# Altium project slave-14-mc33775.PrjPcb (part 1 of 2)
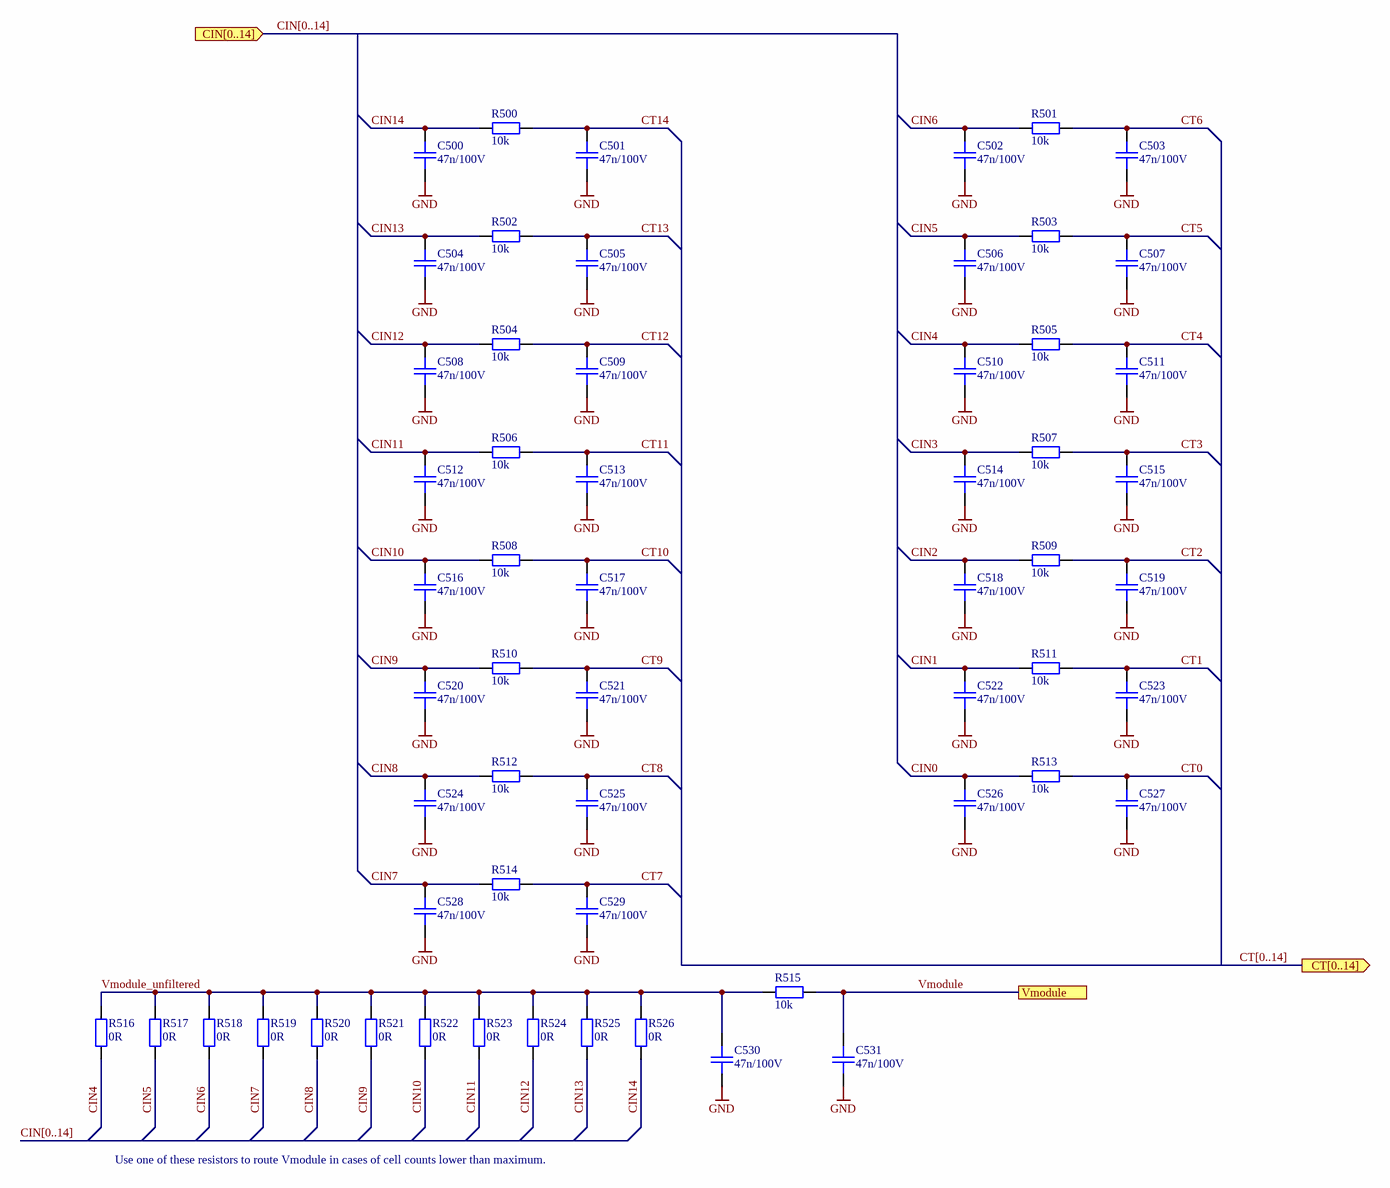
[diagram p0: input_filter.SchDoc]
GlobalAuthor: foxBMS Team; GlobalDate: 2024-11-07; GlobalLicense: Creative Commons Attribution 4.0; GlobalProject: BMS-Slave 14-Cell MC33775; GlobalStatus: A; GlobalVersion: 1.0.2
8 sheets, 209 parts. Net scope: hierarchical (ports join the sheet entries above them; power ports are global).
Board file: slave-14-mc33775.PcbDoc
Sheets:
  input_filter.SchDoc
  analog_in.SchDoc
  connectors_org.SchDoc
  sensors.SchDoc
  digital_io.SchDoc
  ldo.SchDoc
  connectors_new.SchDoc
  connectors.SchDoc

## Sheet input_filter.SchDoc
size A3; DocumentNumber: 3; SheetNumber: 3; SheetTotal: 11; SheetDescription: Cell Input Filter

### Parts
C500  47n/100V  [CAPC1608X08N]
C501  47n/100V  [CAPC1608X08N]
C502  47n/100V  [CAPC1608X08N]
C503  47n/100V  [CAPC1608X08N]
C504  47n/100V  [CAPC1608X08N]
C505  47n/100V  [CAPC1608X08N]
C506  47n/100V  [CAPC1608X08N]
C507  47n/100V  [CAPC1608X08N]
C508  47n/100V  [CAPC1608X08N]
C509  47n/100V  [CAPC1608X08N]
C510  47n/100V  [CAPC1608X08N]
C511  47n/100V  [CAPC1608X08N]
C512  47n/100V  [CAPC1608X08N]
C513  47n/100V  [CAPC1608X08N]
C514  47n/100V  [CAPC1608X08N]
C515  47n/100V  [CAPC1608X08N]
C516  47n/100V  [CAPC1608X08N]
C517  47n/100V  [CAPC1608X08N]
C518  47n/100V  [CAPC1608X08N]
C519  47n/100V  [CAPC1608X08N]
C520  47n/100V  [CAPC1608X08N]
C521  47n/100V  [CAPC1608X08N]
C522  47n/100V  [CAPC1608X08N]
C523  47n/100V  [CAPC1608X08N]
C524  47n/100V  [CAPC1608X08N]
C525  47n/100V  [CAPC1608X08N]
C526  47n/100V  [CAPC1608X08N]
C527  47n/100V  [CAPC1608X08N]
C528  47n/100V  [CAPC1608X08N]
C529  47n/100V  [CAPC1608X08N]
C530  47n/100V  [CAPC1608X08N]
C531  47n/100V  [CAPC1608X08N]
R500  10k  [RESC1608X05N]
R501  10k  [RESC1608X05N]
R502  10k  [RESC1608X05N]
R503  10k  [RESC1608X05N]
R504  10k  [RESC1608X05N]
R505  10k  [RESC1608X05N]
R506  10k  [RESC1608X05N]
R507  10k  [RESC1608X05N]
R508  10k  [RESC1608X05N]
R509  10k  [RESC1608X05N]
R510  10k  [RESC1608X05N]
R511  10k  [RESC1608X05N]
R512  10k  [RESC1608X05N]
R513  10k  [RESC1608X05N]
R514  10k  [RESC1608X05N]
R515  10k  [RESC1608X05N]
R516  0R  [RESC1608X05N]
R517  0R  [RESC1608X05N]
R518  0R  [RESC1608X05N]
R519  0R  [RESC1608X05N]
R520  0R  [RESC1608X05N]
R521  0R  [RESC1608X05N]
R522  0R  [RESC1608X05N]
R523  0R  [RESC1608X05N]
R524  0R  [RESC1608X05N]
R525  0R  [RESC1608X05N]
R526  0R  [RESC1608X05N]

### Ports
CIN[0..14] (in), CT[0..14] (out), Vmodule

### Nets
GND: C500.1 C501.1 C502.1 C503.1 C504.1 C505.1 C506.1 C507.1 C508.1 C509.1 C510.1 C511.1 C512.1 C513.1 C514.1 C515.1 C516.1 C517.1 C518.1 C519.1 C520.1 C521.1 C522.1 C523.1 C524.1 C525.1 C526.1 C527.1 C528.1 C529.1 C530.1 C531.1
CIN0: C526.2 R513.2
CIN1: C522.2 R511.2
CIN2: C518.2 R509.2
CIN3: C514.2 R507.2
CIN4: C510.2 R505.2 R516.1
CIN5: C506.2 R503.2 R517.1
CIN6: C502.2 R501.2 R518.1
CIN7: C528.2 R514.2 R519.1
CIN8: C524.2 R512.2 R520.1
CIN9: C520.2 R510.2 R521.1
CIN10: C516.2 R508.2 R522.1
CIN11: C512.2 R506.2 R523.1
CIN12: C508.2 R504.2 R524.1
CIN13: C504.2 R502.2 R525.1
CIN14: C500.2 R500.2 R526.1
CT0: C527.2 R513.1
CT1: C523.2 R511.1
CT2: C519.2 R509.1
CT3: C515.2 R507.1
CT4: C511.2 R505.1
CT5: C507.2 R503.1
CT6: C503.2 R501.1
CT7: C529.2 R514.1
CT8: C525.2 R512.1
CT9: C521.2 R510.1
CT10: C517.2 R508.1
CT11: C513.2 R506.1
CT12: C509.2 R504.1
CT13: C505.2 R502.1
CT14: C501.2 R500.1
Vmodule: C531.2 R515.1 ; port Vmodule
Vmodule_unfiltered: C530.2 R515.2 R516.2 R517.2 R518.2 R519.2 R520.2 R521.2 R522.2 R523.2 R524.2 R525.2 R526.2

### Buses and harness runs
bus CIN[0..14]
bus CIN[0..14] = port CIN[0..14]
bus CT[0..14] = port CT[0..14]

### Notes on the sheet
- Use one of these resistors to route Vmodule in cases of cell counts lower than maximum.
- Fraunhofer IISB
- Schottkystr. 10
- developed by:
- 91058 Erlangen
- Germany
- Author
- Project
- License
- Description
- File
- Version
- Release Date
- Sheet
- foxbms.org <https://foxbms.org>
- www.iisb.fraunhofer.de <https://www.iisb.fraunhofer.de/>
- foxBMS Team
- /

### Library data of the parts
C500-C531 = gen_C_ceramic_47n_100V_X7R_0603: MLCC; Capacitance: 47n; Rated Voltage: 100V; Dielectric: X7R; Case EIA: 0603; Case Metric: 1608; Automotive Qualified: True; PnP Package: 0603C; Part Number: gen_C_ceramic_47n_100V_X7R_0603; Supplier 1: Farnell; Supplier Part Number 1: 2478249; Supplier 2: Farnell; Supplier Part Number 2: 2708699; Supplier 3: Farnell; Supplier Part Number 3: 2905110
R500-R515 = gen_R_10k_0603: SMD Resistor 10k 0603; Tolerance: 1%; Power: 0.1W; Case EIA: 0603; Case Metric: 1608; Maximum Working Voltage: 75V; PnP Package: 0603R; Automotive Qualified: True; Part Number: gen_R_10k_0603; Operating Temperature: -55°C - +155°C; Resistance: 10k; Series: E24, E96; PnP Value: 10k; Supplier 1: Farnell; Supplier Part Number 1: 2073349
R516-R526 = gen_R_0R_0603: SMD Resistor 0R 0603; Power: 0.1W; Case EIA: 0603; Case Metric: 1608; Maximum Working Voltage: 75V; PnP Package: 0603R; Automotive Qualified: True; PnP equipped: x; Part Number: gen_R_0R_0603; Operating Temperature: -55°C - +155°C; Resistance: 0R; Series: Jumper; PnP Value: 0R; Supplier 1: Farnell; Supplier Part Number 1: 2616580

## Sheet analog_in.SchDoc
size A3; DocumentNumber: 5; SheetNumber: 5; SheetTotal: 11; AUTHOR: Fraunhofer IISB foxBMS Team; SheetDescription: I2C analog multiplexer for temperature inputs
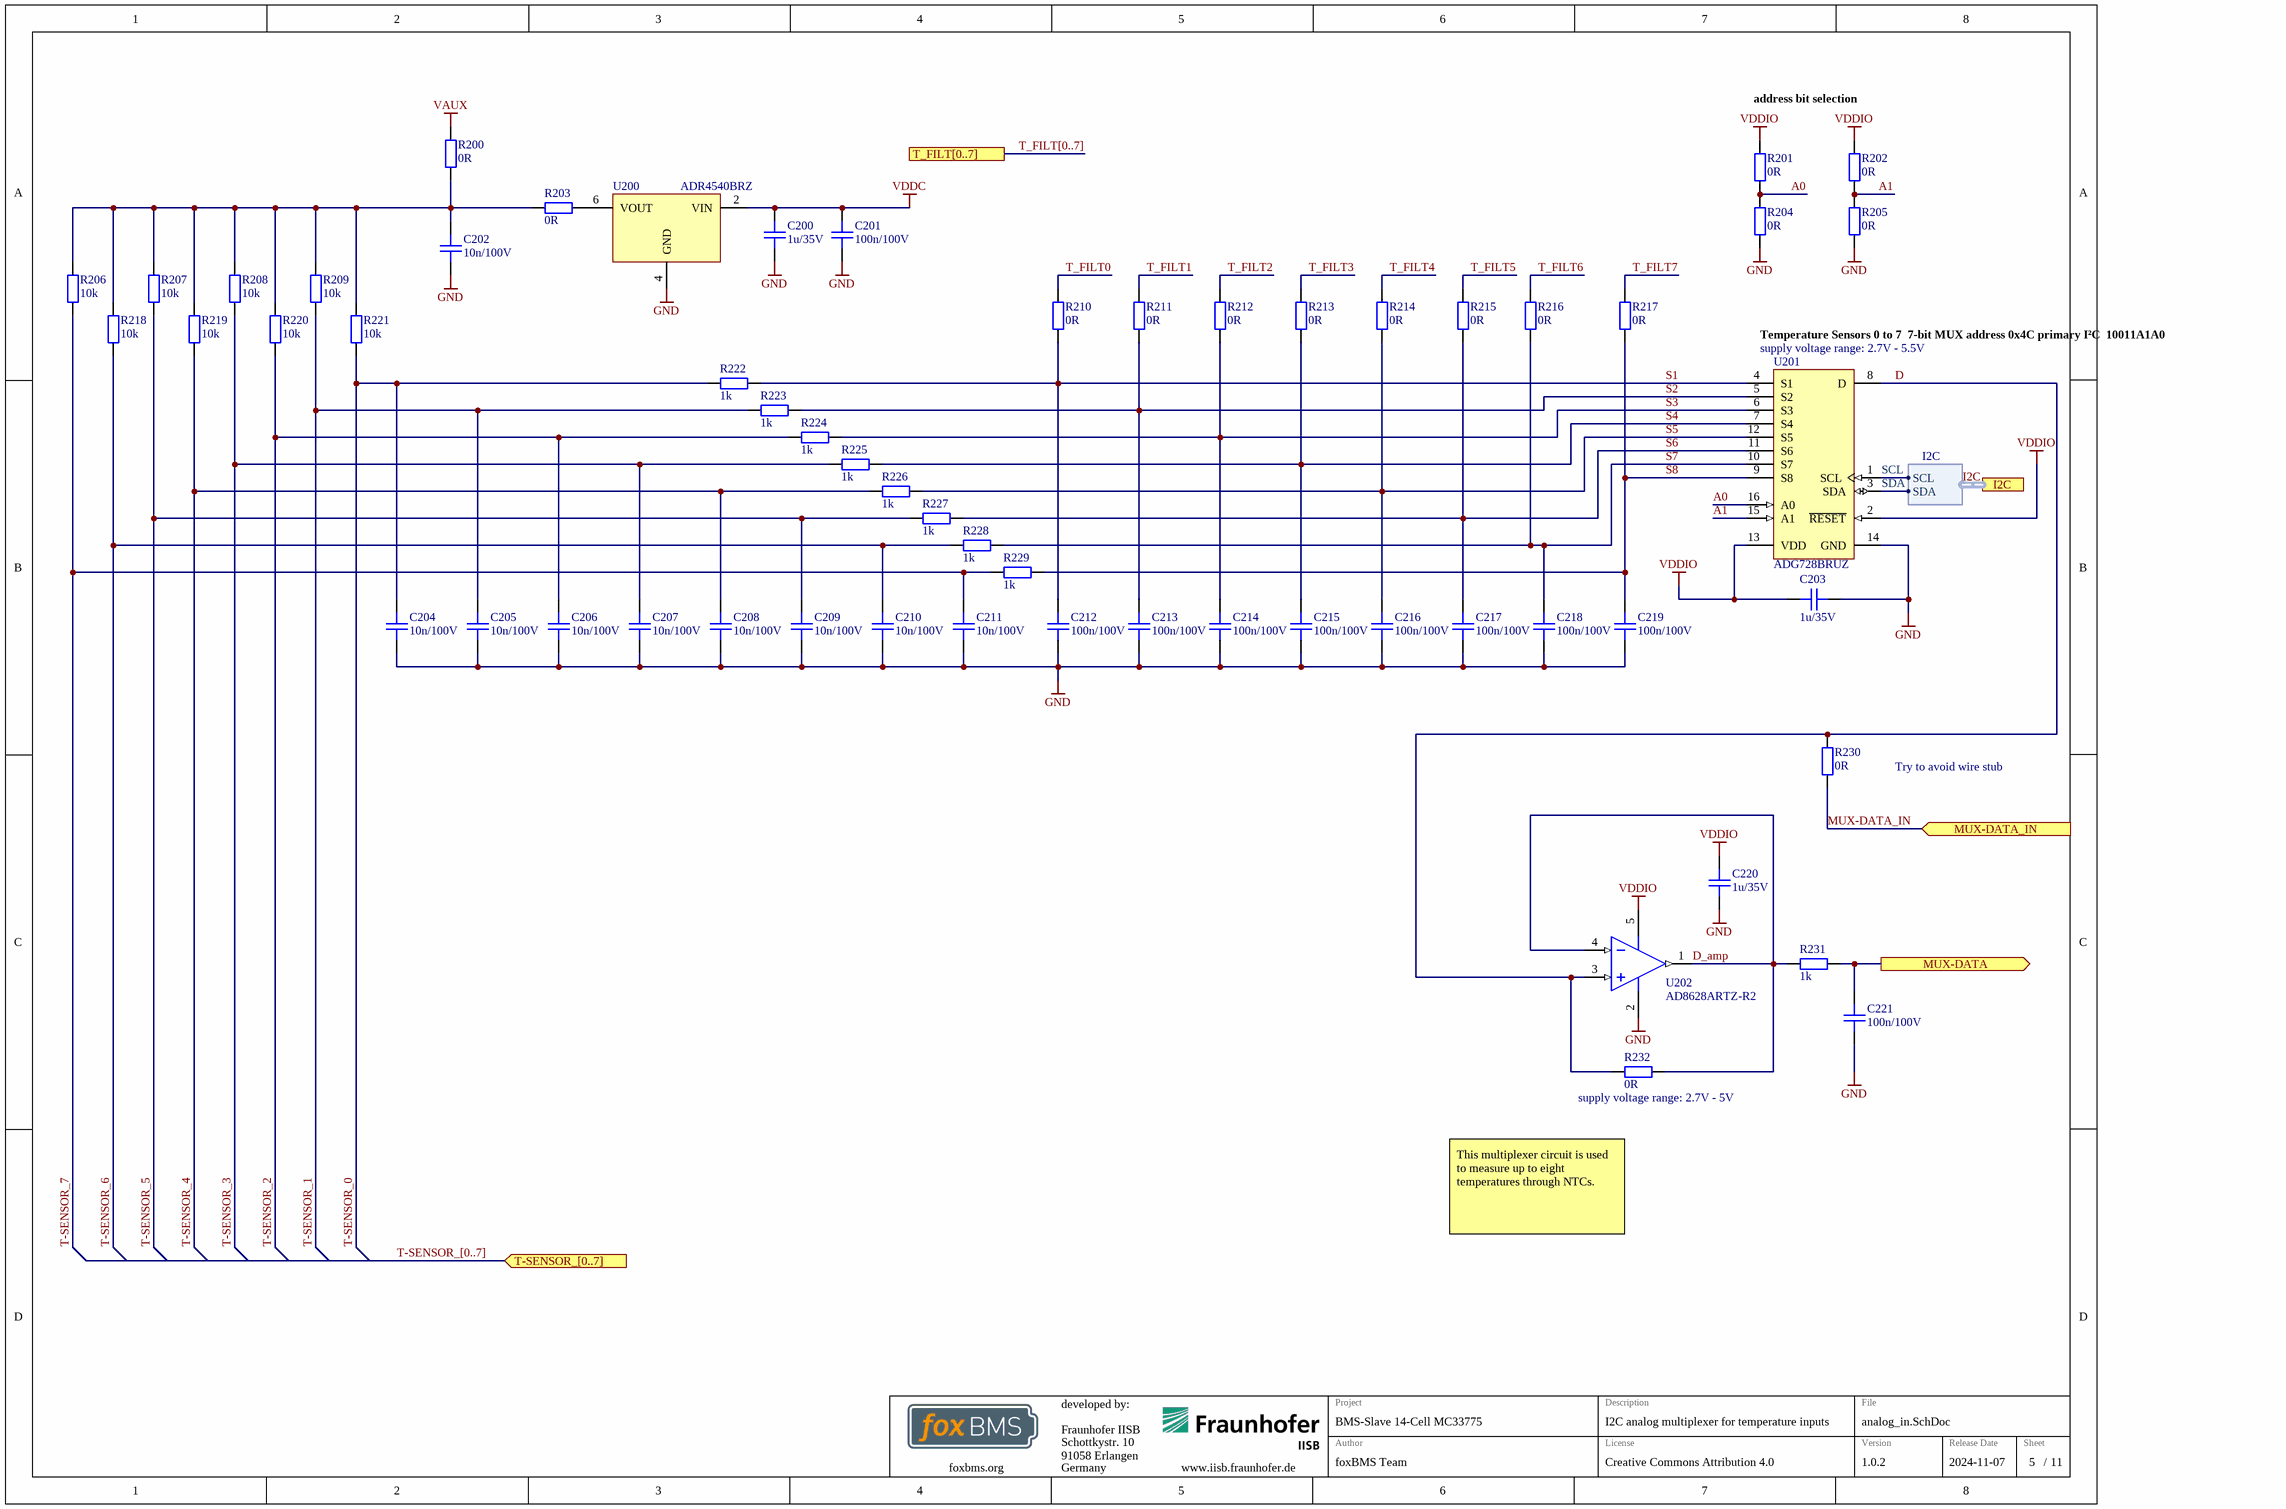
[diagram p1: analog_in.SchDoc]

### Parts
C200  1u/35V  [CAPC1608X08N]
C201  100n/100V  [CAPC1608X08N]
C202  10n/100V  [CAPC1608X08N]
C203  1u/35V  [CAPC1608X08N]
C204  10n/100V  [CAPC1608X08N]
C205  10n/100V  [CAPC1608X08N]
C206  10n/100V  [CAPC1608X08N]
C207  10n/100V  [CAPC1608X08N]
C208  10n/100V  [CAPC1608X08N]
C209  10n/100V  [CAPC1608X08N]
C210  10n/100V  [CAPC1608X08N]
C211  10n/100V  [CAPC1608X08N]
C212  100n/100V  [CAPC1608X08N]
C213  100n/100V  [CAPC1608X08N]
C214  100n/100V  [CAPC1608X08N]
C215  100n/100V  [CAPC1608X08N]
C216  100n/100V  [CAPC1608X08N]
C217  100n/100V  [CAPC1608X08N]
C218  100n/100V  [CAPC1608X08N]
C219  100n/100V  [CAPC1608X08N]
C220  1u/35V  [CAPC1608X08N]
C221  100n/100V  [CAPC1608X08N]
R200  0R  [RESC1608X05N]
R201  0R  [RESC1608X05N]
R202  0R  [RESC1608X05N]
R203  0R  [RESC1608X05N]
R204  0R  [RESC1608X05N]
R205  0R  [RESC1608X05N]
R206  10k  [RESC1608X05N]
R207  10k  [RESC1608X05N]
R208  10k  [RESC1608X05N]
R209  10k  [RESC1608X05N]
R210  0R  [RESC1608X05N]
R211  0R  [RESC1608X05N]
R212  0R  [RESC1608X05N]
R213  0R  [RESC1608X05N]
R214  0R  [RESC1608X05N]
R215  0R  [RESC1608X05N]
R216  0R  [RESC1608X05N]
R217  0R  [RESC1608X05N]
R218  10k  [RESC1608X05N]
R219  10k  [RESC1608X05N]
R220  10k  [RESC1608X05N]
R221  10k  [RESC1608X05N]
R222  1k  [RESC1608X05N]
R223  1k  [RESC1608X05N]
R224  1k  [RESC1608X05N]
R225  1k  [RESC1608X05N]
R226  1k  [RESC1608X05N]
R227  1k  [RESC1608X05N]
R228  1k  [RESC1608X05N]
R229  1k  [RESC1608X05N]
R230  0R  [RESC1608X05N]
R231  1k  [RESC1608X05N]
R232  0R  [RESC1608X05N]
U200  ADR4540BRZ  [SOIC127P600X175-8N]
U201  ADG728BRUZ  [ADI-RU-16_M]
U202  AD8628ARTZ-R2  [ADI-RJ-5_M]

### Ports
I2C (harness I2C), MUX-DATA (out), MUX-DATA_IN (in), T-SENSOR_[0..7] (in), T_FILT[0..7]

### Harnesses
I2C: SCL, SDA

### Nets
GND: C200.1 C201.1 C202.1 C203.1 C204.1 C205.1 C206.1 C207.1 C208.1 C209.1 C210.1 C211.1 C212.1 C213.1 C214.1 C215.1 C216.1 C217.1 C218.1 C219.1 C220.1 C221.1 R204.1 R205.1 U200.4(GND) U201.14(GND) U202.2(-V)
VAUX: R200.2
VDDC: C200.2 C201.2 U200.2(VIN)
VDDIO: C203.2 C220.2 R201.2 R202.2 U201.2(~{RESET}) U201.13(VDD) U202.5(+V)
A0: R201.1 R204.2 U201.16(A0)
A1: R202.1 R205.2 U201.15(A1)
D: R230.1 R232.1 U201.8(D) U202.3(+IN)
D_amp: R231.1 R232.2 U202.1(OUT) U202.4(-IN)
MUX-DATA_IN: R230.2 ; port MUX-DATA_IN
S1: C212.2 R210.1 R222.1 U201.4(S1)
S2: C213.2 R211.1 R223.1 U201.5(S2)
S3: C214.2 R212.1 R224.1 U201.6(S3)
S4: C215.2 R213.1 R225.1 U201.7(S4)
S5: C216.2 R214.1 R226.1 U201.12(S5)
S6: C217.2 R215.1 R227.1 U201.11(S6)
S7: C218.2 R216.1 R228.1 U201.10(S7)
S8: C219.2 R217.1 R229.1 U201.9(S8)
SCL: U201.1(SCL) ; port I2C.SCL  [project net I2C.SCL]
SDA: U201.3(SDA) ; port I2C.SDA  [project net I2C.SDA]
T-SENSOR_0: C204.2 R221.1 R222.2
T-SENSOR_1: C205.2 R209.1 R223.2
T-SENSOR_2: C206.2 R220.1 R224.2
T-SENSOR_3: C207.2 R208.1 R225.2
T-SENSOR_4: C208.2 R219.1 R226.2
T-SENSOR_5: C209.2 R207.1 R227.2
T-SENSOR_6: C210.2 R218.1 R228.2
T-SENSOR_7: C211.2 R206.1 R229.2
T_FILT0: R210.2
T_FILT1: R211.2
T_FILT2: R212.2
T_FILT3: R213.2
T_FILT4: R214.2
T_FILT5: R215.2
T_FILT6: R216.2
T_FILT7: R217.2
NetC202_2: C202.2 R200.1 R203.1 R206.2 R207.2 R208.2 R209.2 R218.2 R219.2 R220.2 R221.2
NetC221_2: C221.2 R231.2 ; port MUX-DATA
NetR203_2: R203.2 U200.6(VOUT)

### Buses and harness runs
bus T-SENSOR_[0..7] = port T-SENSOR_[0..7]
bus T_FILT[0..7] = port T_FILT[0..7]
harness I2C = port I2C

### Notes on the sheet
- address bit selection
- (near U201) Temperature Sensors 0 to 7
  7-bit MUX address 0x4C primary I²C
  10011A1A0
- (near U201) supply voltage range: 2.7V - 5.5V
- Try to avoid wire stub
- (near R232) supply voltage range: 2.7V - 5V
- This multiplexer circuit is used to measure up to eight temperatures through NTCs.
- Fraunhofer IISB
- Schottkystr. 10
- developed by:
- 91058 Erlangen
- Germany
- Author
- Project
- License
- Description
- File
- Version
- Release Date
- Sheet
- foxbms.org <https://foxbms.org>
- www.iisb.fraunhofer.de <https://www.iisb.fraunhofer.de/>
- foxBMS Team
- /

### Library data of the parts
C200 = gen_C_ceramic_1u_35V_X7R_0603: MLCC; Capacitance: 1u; Rated Voltage: 35V; Dielectric: X7R; Case EIA: 0603; Case Metric: 1608; PnP Package: 0603C; PnP Value: 1uF/35V/X7R; PnP equipped: x; Automotive Qualified: True; AEC-Q Norm: AEC-Q200; Part Number: gen_C_ceramic_1u_35V_X7R_0603; Operating Temperature: -55°C - +125°C; Supplier 1: Farnell; Supplier Part Number 1: 2906941; ECCN: EAR99
C201 C212-C219 C221 = gen_C_ceramic_100n_100V_X7R_0603: MLCC; Capacitance: 100n; Rated Voltage: 100V; Dielectric: X7R; Case EIA: 0603; Case Metric: 1608; Automotive Qualified: True; PnP Package: 0603C; Part Number: gen_C_ceramic_100n_100V_X7R_0603; Supplier 1: Digikey; Supplier Part Number 1: 490-13420-1-ND; Supplier 2: Mouser; Supplier Part Number 2: 81-GCJ188R72A104KA1D
C202 = gen_C_ceramic_10n_100V_X7R_0603: MLCC; Capacitance: 10n; Rated Voltage: 100V; Dielectric: X7R; Case EIA: 0603; Case Metric: 1608; Automotive Qualified: True; PnP Package: 0603C; PnP Value: 10nF/100V/X7R; AEC-Q Norm: AEC-Q200; Part Number: gen_C_ceramic_10n_100V_X7R_0603; Supplier 1: Farnell; Supplier Part Number 1: 1301715; Supplier 2: Farnell; Supplier Part Number 2: 2821192; Supplier 3: Farnell; Supplier Part Number 3: 2210878; ECCN: EAR99
C203 C220 = gen_C_ceramic_1u_35V_X7R_0603: MLCC; Capacitance: 1u; Rated Voltage: 35V; Dielectric: X7R; Case EIA: 0603; Case Metric: 1608; Automotive Qualified: True; PnP Package: 0603C; PnP Value: 1uF/35V/X7R; PnP equipped: x; AEC-Q Norm: AEC-Q200; Part Number: gen_C_ceramic_1u_35V_X7R_0603; Supplier 1: Farnell; Supplier Part Number 1: 2906941; Operating Temperature: -55°C - +125°C; ECCN: EAR99
C204-C211 = gen_C_ceramic_10n_100V_X7R_0603: MLCC; Capacitance: 10n; Rated Voltage: 100V; Dielectric: X7R; Case EIA: 0603; Case Metric: 1608; PnP Package: 0603C; PnP Value: 10nF/100V/X7R; Automotive Qualified: True; AEC-Q Norm: AEC-Q200; Part Number: gen_C_ceramic_10n_100V_X7R_0603; Supplier 1: Farnell; Supplier Part Number 1: 1301715; Supplier 2: Farnell; Supplier Part Number 2: 2821192; Supplier 3: Farnell; Supplier Part Number 3: 2210878; ECCN: EAR99
R200-R205 R210-R217 R230 R232 = gen_R_0R_0603: as R516 on sheet input_filter; Part Number: gen_R_0R_0603; Operating Temperature: -55°C - +155°C; Resistance: 0R; Series: Jumper; PnP Value: 0R; Supplier 1: Farnell; Supplier Part Number 1: 2616580
R206-R209 R218-R221 = gen_R_10k_0603: as R500 on sheet input_filter; Part Number: gen_R_10k_0603; Operating Temperature: -55°C - +155°C; Resistance: 10k; Series: E24, E96; PnP Value: 10k; Supplier 1: Farnell; Supplier Part Number 1: 2073349
R222-R229 R231 = gen_R_1k_0603: SMD Resistor 1k 0603; Tolerance: 1%; Power: 0.1W; Case EIA: 0603; Case Metric: 1608; Maximum Working Voltage: 75V; PnP Package: 0603R; Automotive Qualified: True; PnP equipped: x; Part Number: gen_R_1k_0603; Operating Temperature: -55°C - +155°C; Resistance: 1k; Series: E24, E96; PnP Value: 1k; Supplier 1: Farnell; Supplier Part Number 1: 1652848
U200 = ADR4540BRZ: Ultralow Noise, High Accuracy 4.096V Reference; Manufacturer: Analog Devices; PnP Package: SO-8; Automotive Qualified: True; AEC-Q Norm: AEC-Q100; AEC-Q Grade: unknown; Part Number: ADR4540BRZ; Part Name: ADR4540BRZ; Operating Temperature: −40°C - +125°C; ComponentLink1Description: Datasheet; ComponentLink1URL: http://www.analog.com/media/en/technical-documentation/data-sheets/ADR4520_4525_4530_4533_4540_4550.pdf; Supplier 1: Farnell; Supplier Part Number 1: 2112692; Supplier 2: Mouser; Supplier Part Number 2: 584-ADR4540BRZ; Supplier 3: Digikey; Supplier Part Number 3: ADR4540BRZ-ND; ECCN: EAR99
U201 = CMP-0798-00197-1: CMOS, Low Voltage, 2-Wire Serially Controlled, Matrix Switch, -40 to 85 degC, 16-pin SOP (RU-16), Tube; Manufacturer: Analog Devices; Ron (ohms): 2.5; Supply V Guar Performance: Single_(+3V), Single_(+5V); Max Analog Signal Range: 0 to Vdd; Bandwidth (Hz): 65M; ComponentLink3Description: Package Specification; Packing: Tube; PartNumber: ADG728BRUZ; ComponentLink1URL: http://www.analog.com/en/index.html; Mounting Technology: Surface Mount; DatasheetVersion: Rev. C; ComponentLink1Description: Manufacturer URL; ComponentLink3URL: http:/www.analog.com/static/imported-files/packages/36244347913743854010197452789RU16.pdf; ComponentLink2URL: http://www.analog.com/static/imported-files/data_sheets/ADG728_729.pdf; PackageVersion: Nov-02; PackageDescription: 16-Pin Thin Shrink Small Outline Package, Body 5 x 4.4 mm, Pitch 0.65 mm; Code_JEDEC: MO-153AB; PackageReference: RU-16; ComponentLink2Description: Datasheet
U202 = CMP-0384-01512-2: Single Channel RRIO Operational Amplifier, 2.5 MHz BW, 1 V/us SR, Industrial, 5-pin SOT23 (RJ-5), Reel; Manufacturer: Analog Devices; Generic Part Number: AD8628; Iq/Amp: 1.1mA; Automotive Qualified: Yes; V Span Max: 6V; Input Bias Current: 30pA; Slew Rate: 1V/us; Amplifiers Per Package: 1; Input Offset Voltage: 1uV; Small Signal Bandwidth: 2.5MHz; V Span Min: 2.7V; ComponentLink1Description: Manufacturer URL; DatasheetVersion: Rev. I; ComponentLink4Description: Reference Circuit; Code_JEDEC: MO-178-AA; PackageDescription: 5-Pin Small Outline Transistor Package, Body 2.9 x 1.6 mm, Pitch 0.95 mm; ComponentLink3URL: http://www.analog.com/static/imported-files/packages/PKG_PDF/SOT-23(RJ)/RJ_5.pdf; PackageReference: RJ-5; ComponentLink1URL: http://www.analog.com/en/index.html; PackageVersion: 121608-A; RevisionNote: Reference Circuit URL fixed; Mounting Technology: Surface Mount; ComponentLink2Description: Datasheet; ComponentLink3Description: Package Specification; ComponentLink4URL: http://www.analog.com/en/all-operational-amplifiers-op-amps/operational-amplifiers-op-amps/ad8628/products/product.html#product-recommendations; ComponentLink2URL: http://www.analog.com/static/imported-files/data_sheets/AD8628_8629_8630.pdf; PartNumber: AD8628ARTZ-R2

## Sheet connectors_org.SchDoc: foxBMS BMS-Slave 12-Cell
size A3; DocumentNumber: 6; SheetNumber: 6; SheetTotal: 11; AUTHOR: Fraunhofer IISB foxBMS Team; SheetDescription: Connectors
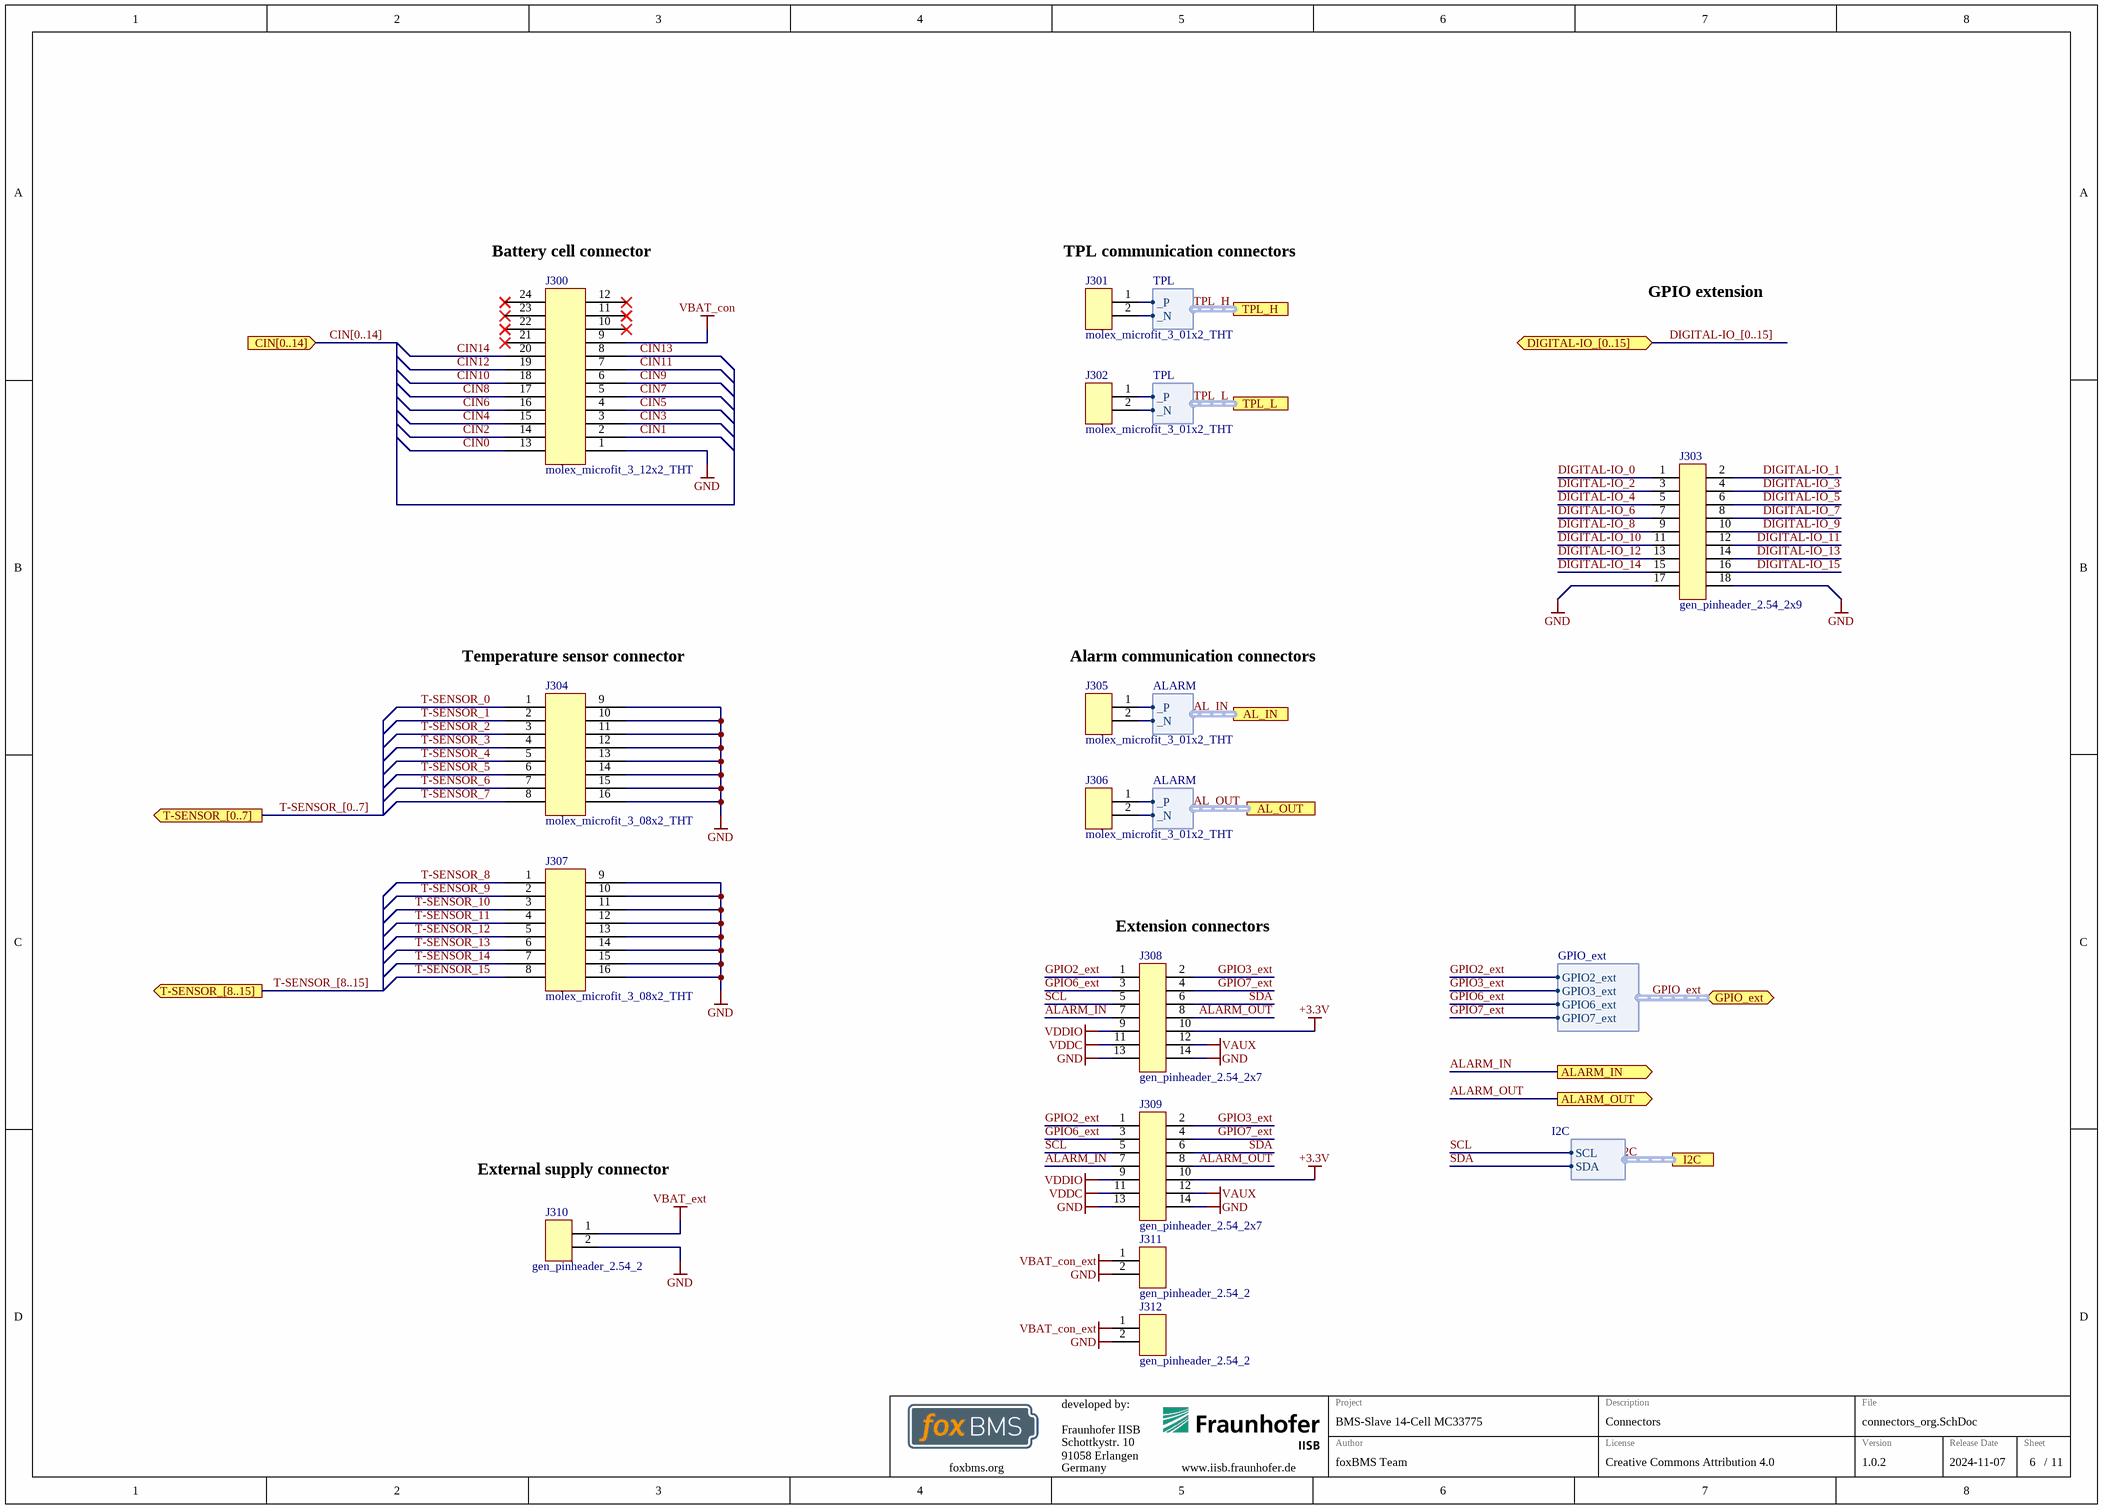
[diagram p2: connectors_org.SchDoc]

### Parts
(Parts that share a designator on the sheet are numbered #1, #2 ... from top to bottom, then left to right.)
J300#1  molex_microfit_3_12x2_THT  [MOLEX_MICROFIT_12x2_THT]
J301#1  molex_microfit_3_01x2_THT  [MOLEX_MICROFIT_01x2_THT]
J302#1  molex_microfit_3_01x2_THT  [MOLEX_MICROFIT_01x2_THT]
J303#1  gen_pinheader_2.54_2x9  [Pinheader_2.54_2x9]
J304#1  molex_microfit_3_08x2_THT  [MOLEX_MICROFIT_08x2_THT]
J305#1  molex_microfit_3_01x2_THT  [MOLEX_MICROFIT_01x2_THT]
J306#1  molex_microfit_3_01x2_THT  [MOLEX_MICROFIT_01x2_THT]
J307#1  molex_microfit_3_08x2_THT  [MOLEX_MICROFIT_08x2_THT]
J308#1  gen_pinheader_2.54_2x7  [Pinheader_2.54_2x7]
J309#1  gen_pinheader_2.54_2x7  [Pinheader_2.54_2x7]
J310  gen_pinheader_2.54_2  [Pinheader_2.54_2]
J311#1  gen_pinheader_2.54_2  [Pinheader_2.54_2]
J312#1  gen_pinheader_2.54_2  [Pinheader_2.54_2]

### Ports
AL_IN (harness ALARM), AL_OUT (harness ALARM), ALARM_IN (out), ALARM_OUT (out), CIN[0..14] (in), DIGITAL-IO_[0..15] (bidir), GPIO_ext (bidir, harness GPIO_ext), I2C (harness I2C), T-SENSOR_[0..7] (out), T-SENSOR_[8..15] (out), TPL_H (harness TPL), TPL_L (harness TPL)

### Harnesses
TPL: _P, _N
ALARM: _P, _N
GPIO_ext: GPIO3_ext, GPIO2_ext, GPIO6_ext, GPIO7_ext
I2C: SCL, SDA

### Nets
+3.3V: J308#1.10 J309#1.10
GND: J300#1.1 J303#1.17 J303#1.18 J304#1.9 J304#1.10 J304#1.11 J304#1.12 J304#1.13 J304#1.14 J304#1.15 J304#1.16 J307#1.9 J307#1.10 J307#1.11 J307#1.12 J307#1.13 J307#1.14 J307#1.15 J307#1.16 J308#1.13 J308#1.14 J309#1.13 J309#1.14 J310.2 J311#1.2 J312#1.2
VAUX: J308#1.12 J309#1.12
VBAT_con: J300#1.9
VBAT_con_ext: J311#1.1 J312#1.1
VBAT_ext: J310.1
VDDC: J308#1.11 J309#1.11
VDDIO: J308#1.9 J309#1.9
AL_IN._N: J305#1.2 ; port AL_IN._N
AL_IN._P: J305#1.1 ; port AL_IN._P
AL_OUT._N: J306#1.2 ; port AL_OUT._N
AL_OUT._P: J306#1.1 ; port AL_OUT._P
ALARM_IN: J308#1.7 J309#1.7 ; port ALARM_IN
ALARM_OUT: J308#1.8 J309#1.8 ; port ALARM_OUT
CIN0: J300#1.13
CIN1: J300#1.2
CIN2: J300#1.14
CIN3: J300#1.3
CIN4: J300#1.15
CIN5: J300#1.4
CIN6: J300#1.16
CIN7: J300#1.5
CIN8: J300#1.17
CIN9: J300#1.6
CIN10: J300#1.18
CIN11: J300#1.7
CIN12: J300#1.19
CIN13: J300#1.8
CIN14: J300#1.20
DIGITAL-IO_0: J303#1.1
DIGITAL-IO_1: J303#1.2
DIGITAL-IO_2: J303#1.3
DIGITAL-IO_3: J303#1.4
DIGITAL-IO_4: J303#1.5
DIGITAL-IO_5: J303#1.6
DIGITAL-IO_6: J303#1.7
DIGITAL-IO_7: J303#1.8
DIGITAL-IO_8: J303#1.9
DIGITAL-IO_9: J303#1.10
DIGITAL-IO_10: J303#1.11
DIGITAL-IO_11: J303#1.12
DIGITAL-IO_12: J303#1.13
DIGITAL-IO_13: J303#1.14
DIGITAL-IO_14: J303#1.15
DIGITAL-IO_15: J303#1.16
GPIO2_ext: J308#1.1 J309#1.1 ; port GPIO_ext.GPIO2_ext
GPIO3_ext: J308#1.2 J309#1.2 ; port GPIO_ext.GPIO3_ext
GPIO6_ext: J308#1.3 J309#1.3 ; port GPIO_ext.GPIO6_ext
GPIO7_ext: J308#1.4 J309#1.4 ; port GPIO_ext.GPIO7_ext
SCL: J308#1.5 J309#1.5 ; port I2C.SCL  [project net I2C.SCL]
SDA: J308#1.6 J309#1.6 ; port I2C.SDA  [project net I2C.SDA]
T-SENSOR_0: J304#1.1
T-SENSOR_1: J304#1.2
T-SENSOR_2: J304#1.3
T-SENSOR_3: J304#1.4
T-SENSOR_4: J304#1.5
T-SENSOR_5: J304#1.6
T-SENSOR_6: J304#1.7
T-SENSOR_7: J304#1.8
T-SENSOR_8: J307#1.1
T-SENSOR_9: J307#1.2
T-SENSOR_10: J307#1.3
T-SENSOR_11: J307#1.4
T-SENSOR_12: J307#1.5
T-SENSOR_13: J307#1.6
T-SENSOR_14: J307#1.7
T-SENSOR_15: J307#1.8
TPL_H._N: J301#1.2 ; port TPL_H._N
TPL_H._P: J301#1.1 ; port TPL_H._P
TPL_L._N: J302#1.2 ; port TPL_L._N
TPL_L._P: J302#1.1 ; port TPL_L._P

Not connected (* = marked no-connect by the designer): J300#1 10* 11* 12* 21* 22* 23* 24*

### Buses and harness runs
bus CIN[0..14] = port CIN[0..14]
bus DIGITAL-IO_[0..15] = port DIGITAL-IO_[0..15]
bus T-SENSOR_[0..7] = port T-SENSOR_[0..7]
bus T-SENSOR_[8..15] = port T-SENSOR_[8..15]
harness AL_IN = port AL_IN
harness AL_OUT = port AL_OUT
harness GPIO_ext = port GPIO_ext
harness I2C = port I2C
harness TPL_H = port TPL_H
harness TPL_L = port TPL_L

### Notes on the sheet
- (near J300#1) Battery cell connector
- (near J301#1) TPL communication connectors
- GPIO extension
- (near J304#1) Temperature sensor connector
- (near J305#1) Alarm communication connectors
- (near J308#1) Extension connectors
- External supply connector
- Fraunhofer IISB
- Schottkystr. 10
- developed by:
- 91058 Erlangen
- Germany
- Author
- Project
- License
- Description
- File
- Version
- Release Date
- Sheet
- foxbms.org <https://foxbms.org>
- www.iisb.fraunhofer.de <https://www.iisb.fraunhofer.de/>
- foxBMS Team
- /

### Library data of the parts
J300#1 = molex_microfit_3_12x2_THT: Micro-Fit 3.0 Right Angle Header, 3.00mm Pitch, Dual Row, 24 Circuits, with Snap-in Plastic Peg PCB Lock, Tin, Glow Wire Capable, Black, 43045-2400; Manufacturer: Molex; Circuits: 24; Rated Voltage: 600V; Rated Current: 8.5A; Automotive Qualified: False; Part Number: molex_microfit_3_12x2_THT; Part Name: MicroFit; Operating Temperature: -40°C - +105°C; Supplier 1: Farnell; Supplier Part Number 1: 1012245; ECCN: EAR99
J301#1 J302#1 J305#1 J306#1 = molex_microfit_3_01x2_THT: Micro-Fit 3.0 Right Angle Header, 3.00mm Pitch, Dual Row, 2 Circuits, with Snap-in Plastic Peg PCB Lock, Tin, Glow Wire Capable, Black, 43045-0200; Manufacturer: Molex; Circuits: 2; Rated Voltage: 600V; Rated Current: 8.5A; Automotive Qualified: False; Part Number: molex_microfit_3_01x2_THT; Part Name: MicroFit; Operating Temperature: -40°C - +105°C; Supplier 1: Farnell; Supplier Part Number 1: 1012251; ECCN: EAR99
J303#1 = gen_pinheader_2.54_2x9: Standard Pinheader, THD, gerade, 2.54mm, 2-reihig; Circuits: 18; Rated Voltage: 250V; Rated Current: 3A; Automotive Qualified: False; Part Number: gen_pinheader_2.54_2x9; Part Name: PinHeader; Operating Temperature: −40 °C - +105 °C; Supplier 1: Farnell; Supplier Part Number 1: 2025256
J304#1 J307#1 = molex_microfit_3_08x2_THT: Micro-Fit 3.0 Right Angle Header, 3.00mm Pitch, Dual Row, 16 Circuits, with Snap-in Plastic Peg PCB Lock, Tin, Glow Wire Capable, Black, 43045-1600; Manufacturer: Molex; Circuits: 16; Rated Voltage: 600V; Rated Current: 8.5A; Automotive Qualified: False; Part Number: molex_microfit_3_08x2_THT; Part Name: MicroFit; Operating Temperature: -40°C - +105°C; Supplier 1: Farnell; Supplier Part Number 1: 9961380; ECCN: EAR99
J308#1 J309#1 = gen_pinheader_2.54_2x7: Standard Pinheader, THD, gerade, 2.54mm, 2-reihig; Circuits: 14; Rated Voltage: 250V; Rated Current: 3A; Automotive Qualified: False; Part Number: gen_pinheader_2.54_2x7; Part Name: PinHeader; Operating Temperature: −40 °C - +105 °C; Supplier 1: Mouser; Supplier Part Number 1: 200-TSW10707GD
J310 J311#1 J312#1 = gen_pinheader_2.54_2: Standard Pinheader, THD, gerade, 2.54mm; Circuits: 2; Rated Voltage: 250V; Rated Current: 3A; Automotive Qualified: False; Part Number: gen_pinheader_2.54_2; Part Name: PinHeader; Operating Temperature: −40 °C - +105 °C; Supplier 1: Farnell; Supplier Part Number 1: 2505044

## Sheet sensors.SchDoc
size A3; DocumentNumber: 10; SheetNumber: 10; SheetTotal: 11; SheetDescription: Environmental Sensors
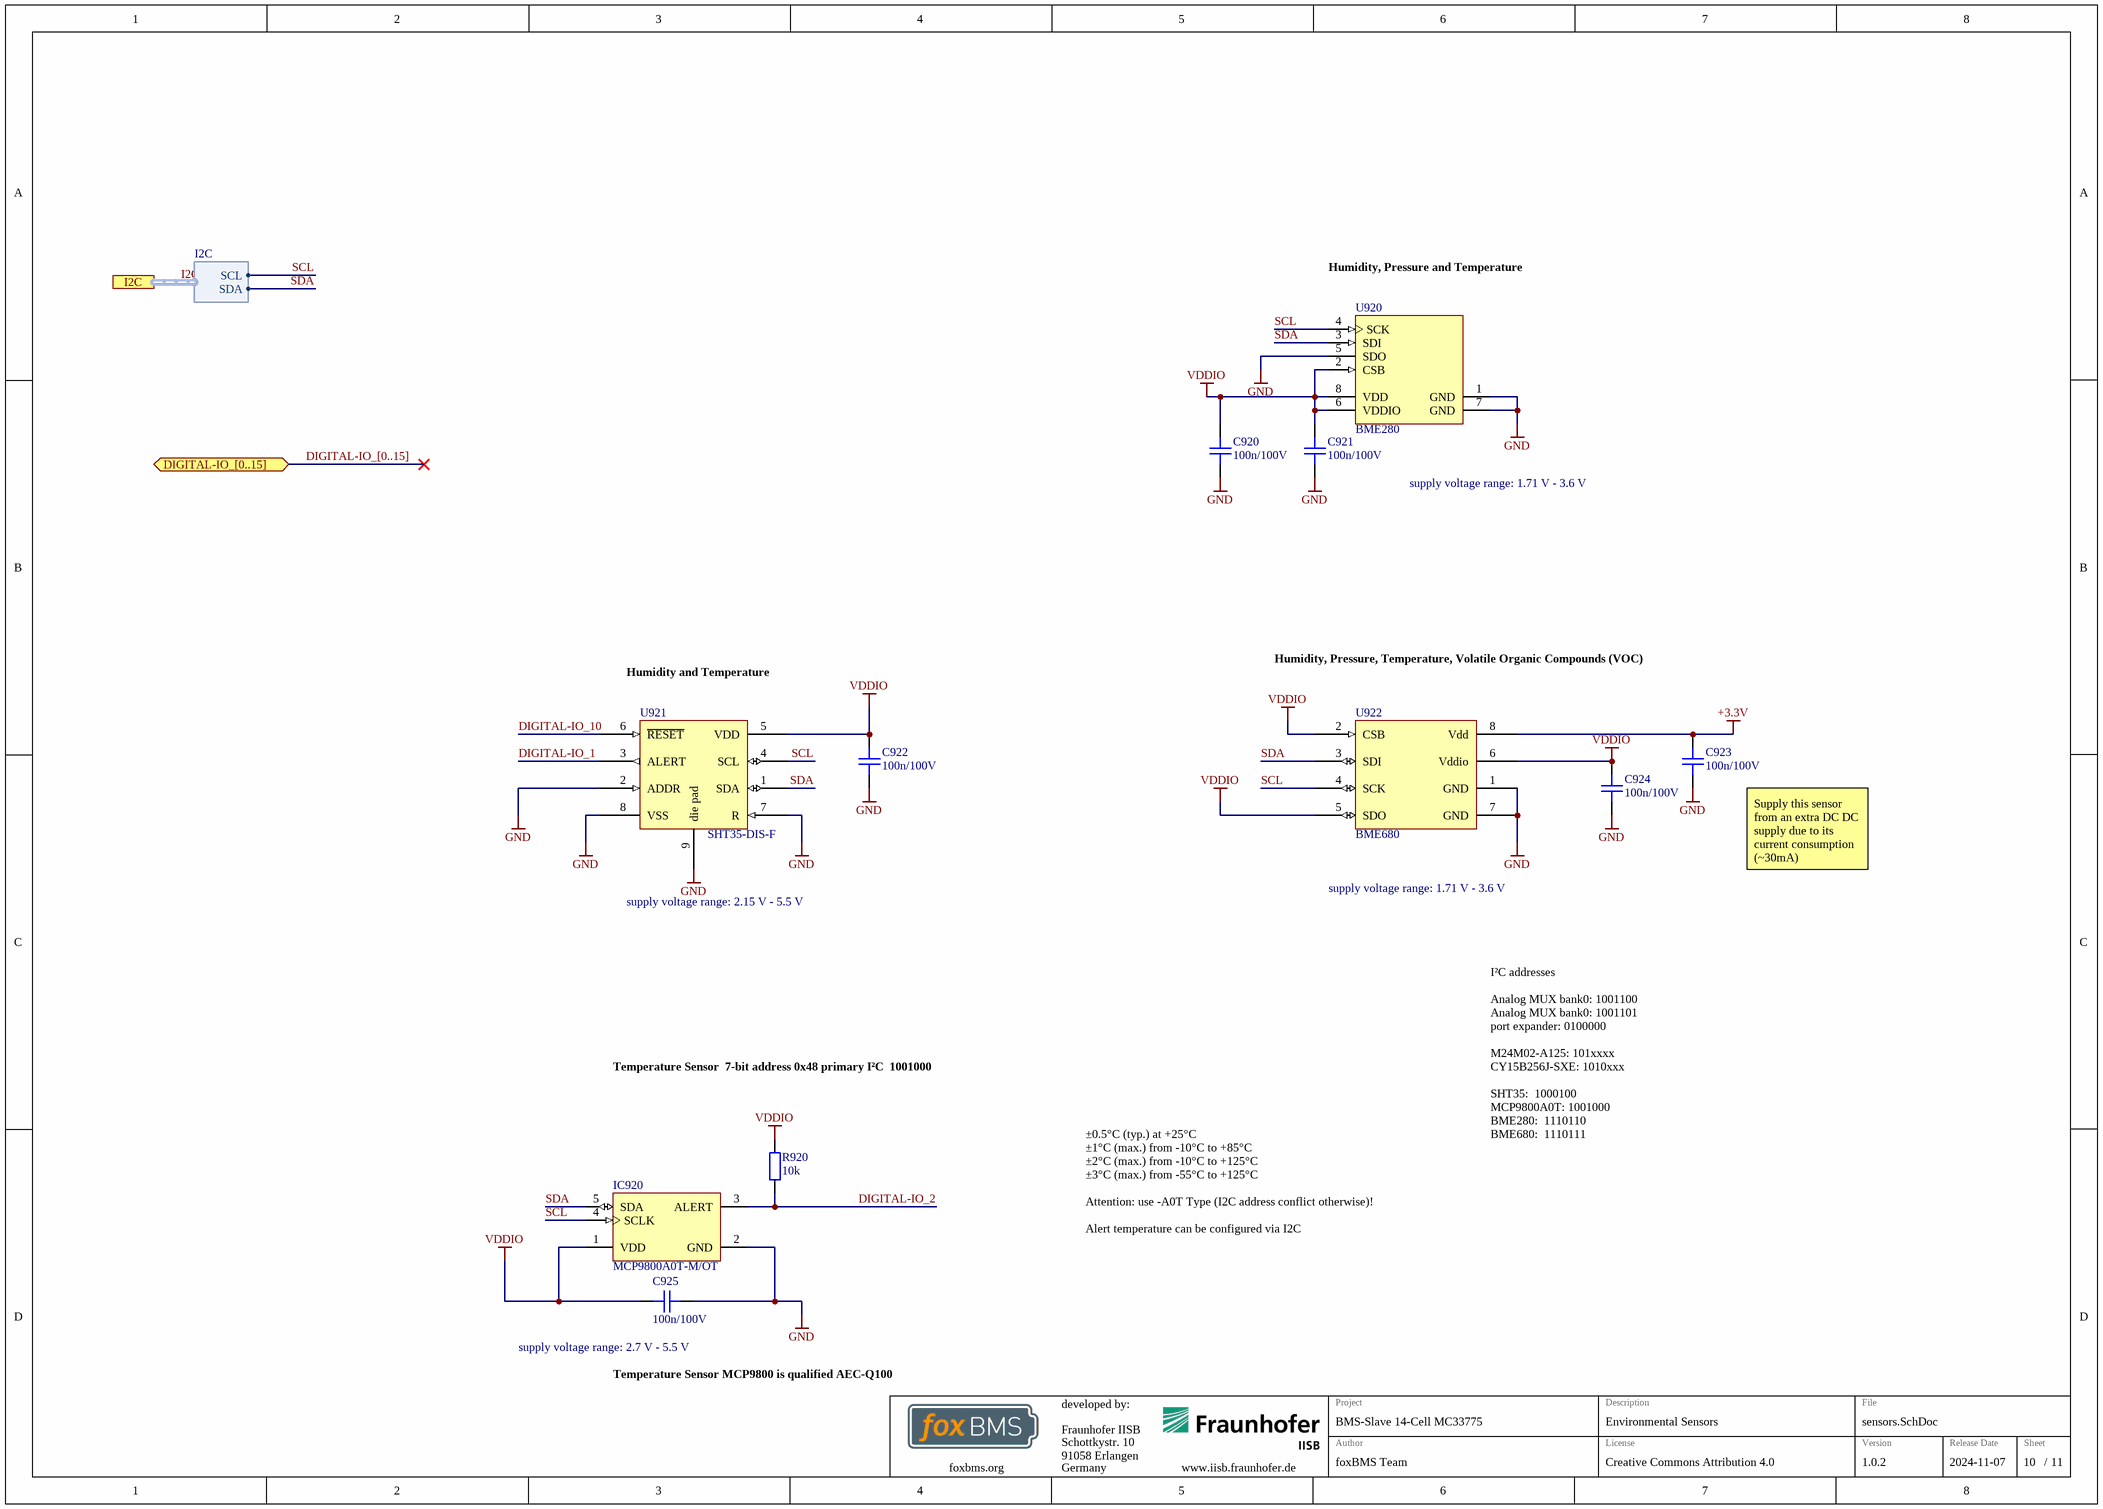
[diagram p3: sensors.SchDoc]

### Parts
C920  100n/100V  [CAPC1608X08N]
C921  100n/100V  [CAPC1608X08N]
C922  100n/100V  [CAPC1608X08N]
C923  100n/100V  [CAPC1608X08N]
C924  100n/100V  [CAPC1608X08N]
C925  100n/100V  [CAPC1608X08N]
IC920  MCP9800A0T-M/OT  [SOT-23-OT5_L]
R920  10k  [RESC1608X05N]
U920  BME280  [BOSC-BME280-8_V]
U921  SHT35-DIS-F  [SHT3X]
U922  BME680  [BME680]

### Ports
DIGITAL-IO_[0..15] (bidir), I2C (harness I2C)

### Harnesses
I2C: SCL, SDA

### Nets
+3.3V: C923.2 U922.8(Vdd)
GND: C920.1 C921.1 C922.1 C923.1 C924.1 C925.1 IC920.2(GND) U920.1(GND) U920.5(SDO) U920.7(GND) U921.2(ADDR) U921.7(R) U921.8(VSS) U921.9(die_pad) U922.1(GND) U922.7(GND)
VDDIO: C920.2 C921.2 C922.2 C924.2 C925.2 IC920.1(VDD) R920.2 U920.2(CSB) U920.6(VDDIO) U920.8(VDD) U921.5(VDD) U922.2(CSB) U922.5(SDO) U922.6(Vddio)
DIGITAL-IO_1: U921.3(ALERT)
DIGITAL-IO_2: IC920.3(ALERT) R920.1
DIGITAL-IO_10: U921.6(~{RESET})
SCL: IC920.4(SCLK) U920.4(SCK) U921.4(SCL) U922.4(SCK) ; port I2C.SCL  [project net I2C.SCL]
SDA: IC920.5(SDA) U920.3(SDI) U921.1(SDA) U922.3(SDI) ; port I2C.SDA  [project net I2C.SDA]

### Buses and harness runs
bus DIGITAL-IO_[0..15] = port DIGITAL-IO_[0..15]
harness I2C = port I2C

### Notes on the sheet
- Humidity, Pressure and Temperature
- supply voltage range: 1.71 V - 3.6 V
- Humidity and Temperature
- Humidity, Pressure, Temperature, Volatile Organic Compounds (VOC)
- supply voltage range: 2.15 V - 5.5 V
- Supply this sensor from an extra DC DC supply due to its current consumption (~30mA)
- Temperature Sensor
  7-bit address 0x48 primary I²C
  1001000
- ±0.5°C (typ.) at +25°C
  ±1°C (max.) from -10°C to +85°C
  ±2°C (max.) from -10°C to +125°C
  ±3°C (max.) from -55°C to +125°C
  Attention: use -A0T Type (I2C address conflict otherwise)!
  Alert temperature can be configured via I2C
- I²C addresses
  Analog MUX bank0:	1001100
  Analog MUX bank0:	1001101
  port expander:	0100000
  M24M02-A125:	101xxxx
  CY15B256J-SXE:	1010xxx
  SHT35:		1000100
  MCP9800A0T:	1001000
  BME280:		1110110
  BME680:		1110111
- (near C925) supply voltage range: 2.7 V - 5.5 V
- Temperature Sensor MCP9800 is qualified AEC-Q100
- Fraunhofer IISB
- Schottkystr. 10
- developed by:
- 91058 Erlangen
- Germany
- Author
- Project
- License
- Description
- File
- Version
- Release Date
- Sheet
- foxbms.org <https://foxbms.org>
- www.iisb.fraunhofer.de <https://www.iisb.fraunhofer.de/>
- foxBMS Team
- /

### Library data of the parts
C920-C925 = gen_C_ceramic_100n_100V_X7R_0603: as C201 on sheet analog_in; Part Number: gen_C_ceramic_100n_100V_X7R_0603; Supplier 1: Digikey; Supplier Part Number 1: 490-13420-1-ND; Supplier 2: Mouser; Supplier Part Number 2: 81-GCJ188R72A104KA1D
IC920 = CMP-0192-00211-1: 2-Wire High-Accuracy Temperature Sensor, Slave Address 000, 5-Pin SOT-23, -55°C to +125°C Temperature, Tape and Reel; PackageReference: SOT-23-OT5; PackageVersion: revBB, Aug-2009; DatasheetVersion: revD, Nov-2010; PackageDescription: 5-Lead Plastic Small Outline Transistor (OT) [SOT-23]; Code_IPC: SOT23-5
R920 = gen_R_10k_0603: as R500 on sheet input_filter; Part Number: gen_R_10k_0603; Operating Temperature: -55°C - +155°C; Resistance: 10k; Series: E24, E96; PnP Value: 10k; Supplier 1: Farnell; Supplier Part Number 1: 2073349
U920 = BME280: Low power pressure, temperature & humidity sensor; Manufacturer: Bosch Sensortec; PnP Package: LGA; Automotive Qualified: False; Datasheet Version: Rev. 1.2, 10/2015; Datasheet URL: http://datasheet.octopart.com/BME280-Bosch-datasheet-58577763.pdf; Manufacturer URL: http://www.bosch-sensortec.com; Part Number: BME280; Part Name: BME280; Operating Temperature: -40°C - +85°C; ComponentLink1Description: Datasheet; ComponentLink1URL: https://ae-bst.resource.bosch.com/media/_tech/media/datasheets/BST-BME280-DS002.pdf; Supplier 1: Digikey; Supplier Part Number 1: 828-1063-1-ND; Supplier 2: Mouser; Supplier Part Number 2: 262-BME280
U921 = SHT35-DIS-F: Humidity/Temp Sensor, Digital, Dfn-8; Manufacturer: Sensirion; PnP Package: DFN; Automotive Qualified: True; Part Number: SHT35-DIS-F; Part Name: SHT35-DIS-F; Operating Temperature: -40°C - +125°C; ComponentLink1Description: Datasheet; ComponentLink1URL: http://www.farnell.com/datasheets/2756487.pdf; Supplier 1: Farnell; Supplier Part Number 1: 2886656; Supplier 2: Digikey; Supplier Part Number 2: 1649-1067-1-ND; Supplier 3: Mouser; Supplier Part Number 3: 403-SHT35-DIS-F
U922 = BME680: Low power gas, pressure, temperature & humidity sensor; Manufacturer: Bosch Sensortec; PnP Package: LGA; Automotive Qualified: False; Part Number: BME680; Part Name: BME680; Operating Temperature: -40°C - +85°C; ComponentLink1Description: Datasheet; ComponentLink1URL: https://ae-bst.resource.bosch.com/media/_tech/media/datasheets/BST-BME680-DS001.pdf; Supplier 1: Digikey; Supplier Part Number 1: 828-1077-1-ND; Supplier 2: Mouser; Supplier Part Number 2: 262-BME680

## Sheet digital_io.SchDoc: foxBMS BMS-Slave 12-Cell
size A3; DocumentNumber: 11; SheetNumber: 11; SheetTotal: 11; AUTHOR: Fraunhofer IISB foxBMS Team; SheetDescription: Digital Inputs/Outputs
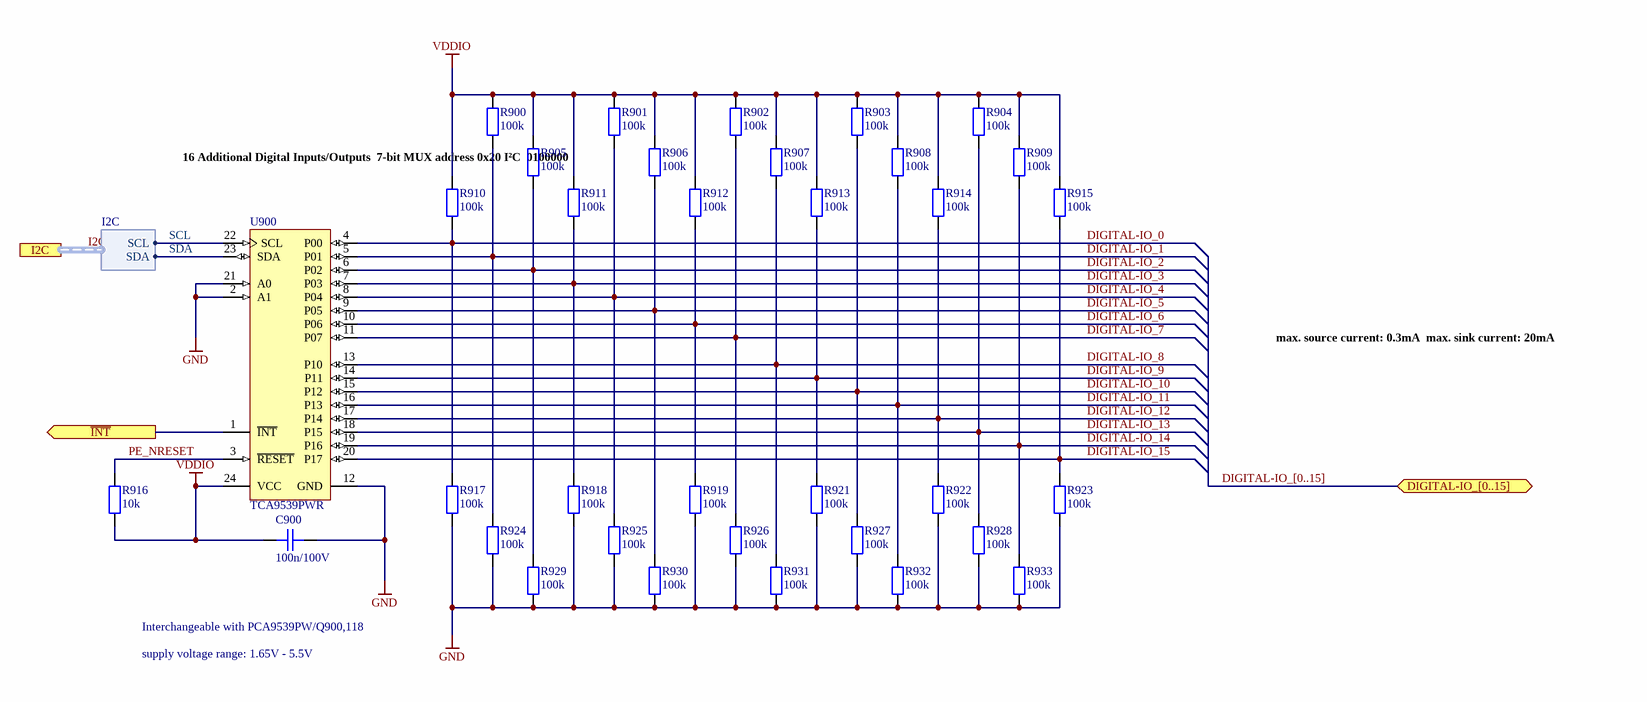
[diagram p4: digital_io.SchDoc]

### Parts
C900  100n/100V  [CAPC1608X08N]
R900  100k  [RESC1608X05N]
R901  100k  [RESC1608X05N]
R902  100k  [RESC1608X05N]
R903  100k  [RESC1608X05N]
R904  100k  [RESC1608X05N]
R905  100k  [RESC1608X05N]
R906  100k  [RESC1608X05N]
R907  100k  [RESC1608X05N]
R908  100k  [RESC1608X05N]
R909  100k  [RESC1608X05N]
R910  100k  [RESC1608X05N]
R911  100k  [RESC1608X05N]
R912  100k  [RESC1608X05N]
R913  100k  [RESC1608X05N]
R914  100k  [RESC1608X05N]
R915  100k  [RESC1608X05N]
R916  10k  [RESC1608X05N]
R917  100k  [RESC1608X05N]
R918  100k  [RESC1608X05N]
R919  100k  [RESC1608X05N]
R921  100k  [RESC1608X05N]
R922  100k  [RESC1608X05N]
R923  100k  [RESC1608X05N]
R924  100k  [RESC1608X05N]
R925  100k  [RESC1608X05N]
R926  100k  [RESC1608X05N]
R927  100k  [RESC1608X05N]
R928  100k  [RESC1608X05N]
R929  100k  [RESC1608X05N]
R930  100k  [RESC1608X05N]
R931  100k  [RESC1608X05N]
R932  100k  [RESC1608X05N]
R933  100k  [RESC1608X05N]
U900  TCA9539PWR  [PW0024A_M]

### Ports
DIGITAL-IO_[0..15] (bidir), I2C (harness I2C), ~{INT} (out)

### Harnesses
I2C: SCL, SDA

### Nets
GND: C900.1 R917.1 R918.1 R919.1 R921.1 R922.1 R923.1 R924.1 R925.1 R926.1 R927.1 R928.1 R929.1 R930.1 R931.1 R932.1 R933.1 U900.2(A1) U900.12(GND) U900.21(A0)
VDDIO: C900.2 R900.2 R901.2 R902.2 R903.2 R904.2 R905.2 R906.2 R907.2 R908.2 R909.2 R910.2 R911.2 R912.2 R913.2 R914.2 R915.2 R916.1 U900.24(VCC)
DIGITAL-IO_0: R910.1 R917.2 U900.4(P00)
DIGITAL-IO_1: R900.1 R924.2 U900.5(P01)
DIGITAL-IO_2: R905.1 R929.2 U900.6(P02)
DIGITAL-IO_3: R911.1 R918.2 U900.7(P03)
DIGITAL-IO_4: R901.1 R925.2 U900.8(P04)
DIGITAL-IO_5: R906.1 R930.2 U900.9(P05)
DIGITAL-IO_6: R912.1 R919.2 U900.10(P06)
DIGITAL-IO_7: R902.1 R926.2 U900.11(P07)
DIGITAL-IO_8: R907.1 R931.2 U900.13(P10)
DIGITAL-IO_9: R913.1 R921.2 U900.14(P11)
DIGITAL-IO_10: R903.1 R927.2 U900.15(P12)
DIGITAL-IO_11: R908.1 R932.2 U900.16(P13)
DIGITAL-IO_12: R914.1 R922.2 U900.17(P14)
DIGITAL-IO_13: R904.1 R928.2 U900.18(P15)
DIGITAL-IO_14: R909.1 R933.2 U900.19(P16)
DIGITAL-IO_15: R915.1 R923.2 U900.20(P17)
PE_NRESET: R916.2 U900.3(~{RESET})
SCL: U900.22(SCL) ; port I2C.SCL  [project net I2C.SCL]
SDA: U900.23(SDA) ; port I2C.SDA  [project net I2C.SDA]
NetU900_1: U900.1(~{INT}) ; port ~{INT}

### Buses and harness runs
bus DIGITAL-IO_[0..15] = port DIGITAL-IO_[0..15]
harness I2C = port I2C

### Notes on the sheet
- (near R905) 16 Additional Digital Inputs/Outputs
  7-bit MUX address 0x20 I²C
  0100000
- max. source current: 0.3mA
  max. sink current: 20mA
- Interchangeable with PCA9539PW/Q900,118
- supply voltage range: 1.65V - 5.5V
- Fraunhofer IISB
- Schottkystr. 10
- developed by:
- 91058 Erlangen
- Germany
- Author
- Project
- License
- Description
- File
- Version
- Release Date
- Sheet
- foxbms.org <https://foxbms.org>
- www.iisb.fraunhofer.de <https://www.iisb.fraunhofer.de/>
- foxBMS Team
- /

### Library data of the parts
C900 = gen_C_ceramic_100n_100V_X7R_0603: as C201 on sheet analog_in; Part Number: gen_C_ceramic_100n_100V_X7R_0603; Supplier 1: Digikey; Supplier Part Number 1: 490-13420-1-ND; Supplier 2: Mouser; Supplier Part Number 2: 81-GCJ188R72A104KA1D
R900-R915 R917-R919 R921-R933 = gen_R_100k_0603: SMD Resistor 100k 0603; Tolerance: 1%; Power: 0.1W; Case EIA: 0603; Case Metric: 1608; Maximum Working Voltage: 75V; PnP Package: 0603R; Automotive Qualified: True; PnP equipped: x; Part Number: gen_R_100k_0603; Operating Temperature: -55°C - +155°C; Resistance: 100k; Series: E24, E96; PnP Value: 100k; Supplier 1: Farnell; Supplier Part Number 1: 2303232
R916 = gen_R_10k_0603: as R500 on sheet input_filter; Part Number: gen_R_10k_0603; Operating Temperature: -55°C - +155°C; Resistance: 10k; Series: E24, E96; PnP Value: 10k; Supplier 1: Farnell; Supplier Part Number 1: 2073349
U900 = CMP-0314-00251-2: Remote 16-Bit I2C and SMBus, Low-Power I/O Expander with Interrupt Output, Reset & Config. Register, 1.65 to 5.5 V, -40 to 85 degC, 24-pin TSSOP (PW), Green (RoHS & no Sb/Br); Manufacturer: Texas Instruments; Interrupt Output: Yes; SubFamily: I2C IO Expander; I2C Address: 1110 1xx; # of I/Os: 16; Max Frequency(kHz): 400; 5V Tolerant I/O: Yes; ComponentLink1Description: Datasheet; PartNumber: TCA9539PWR; Eco-Plan: Green (RoHS & no Sb/Br); Reset Input: Yes; ComponentLink2Description: Package Specification; Mounting Technology: Surface Mount; PackageReference: PW0024A; DatasheetVersion: SCPS202A; ComponentLink1URL: http://www.ti.com/general/docs/lit/getliterature.tsp?genericPartNumber=TCA9539&fileType=pdf; Vcc range(V): 1.65 to 5.5; Low Power: Yes; Code_JEDEC: MO-153; Configuration Registers: Yes; PackageVersion: revG, Feb-2011; PackageDescription: 24-Pin Thin Small Outline Package 0.65 mm Pitch; Push-Pull I/O Type: Yes; ComponentLink2URL: http://www.ti.com/litv/pdf/mpds177g

## Sheet ldo.SchDoc
size A3; DocumentNumber: 8; SheetNumber: 8; SheetTotal: 11; SheetDescription: LDO supply for VDDIO
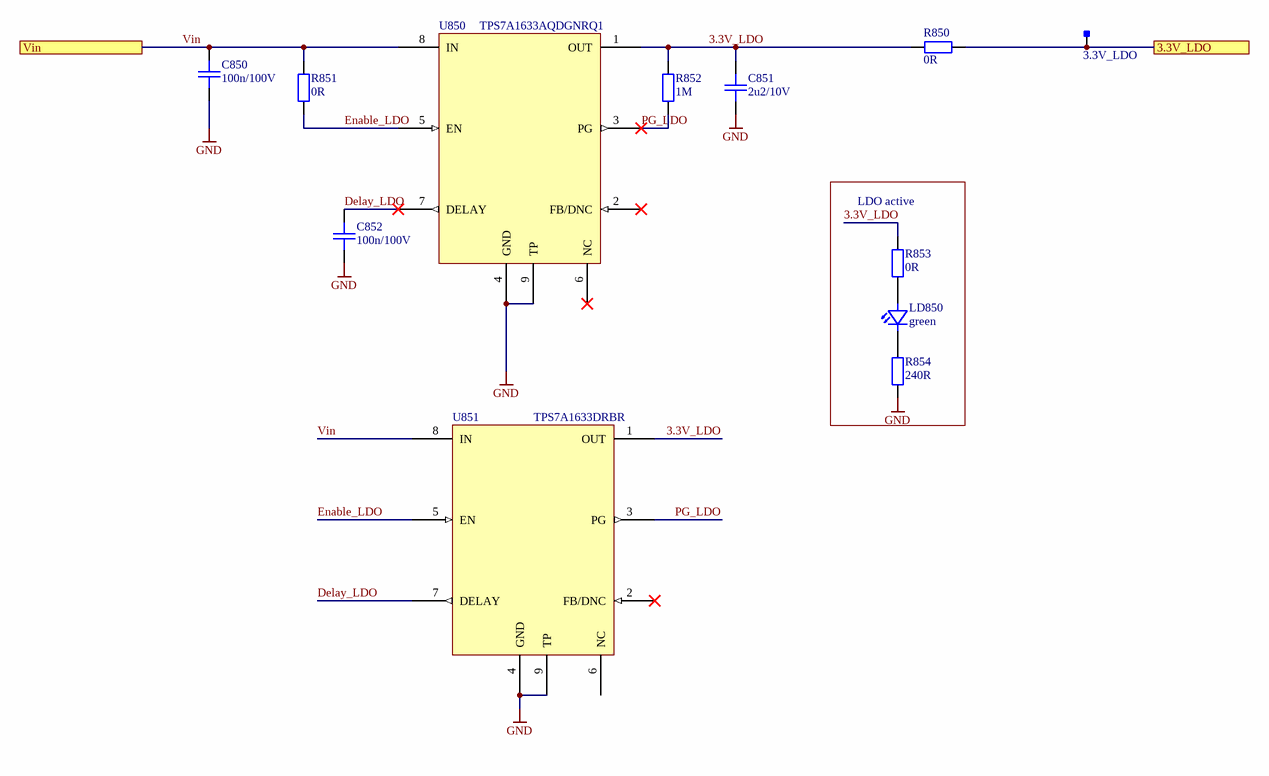
[diagram p5: ldo.SchDoc]

### Parts
3.3V_LDO  Testpoint_Square  [Testpoint_S1]  (value not drawn)  (no BOM)
C850  100n/100V  [CAPC1608X08N]
C851  2u2/10V  [CAPC2012X14N]
C852  100n/100V  [CAPC1608X08N]
LD850  green  [LEDC1608X07N]
R850  0R  [RESC1608X05N]
R851  0R  [RESC1608X05N]
R852  1M  [RESC1608X05N]
R853  0R  [RESC1608X05N]
R854  240R  [RESC1608X05N]
U850  TPS7A1633AQDGNRQ1  [TPS7A16A-Q1]
U851  TPS7A1633DRBR  [TPS7A16_VSON]

### Blocks framed on the sheet
LDO active: LD850 R853 R854

### Ports
3.3V_LDO, Vin

### Nets
GND: C850.1 C851.1 C852.1 R854.1 U850.4(GND) U850.9(TP) U851.4(GND) U851.9(TP)
3.3V_LDO: C851.2 R850.1 R852.2 R853.2 U850.1(OUT) U851.1(OUT)
Delay_LDO: C852.2 U850.7(DELAY) U851.7(DELAY)
Enable_LDO: R851.1 U850.5(EN) U851.5(EN)
PG_LDO: R852.1 U850.3(PG) U851.3(PG)
Vin: C850.2 R851.2 U850.8(IN) U851.8(IN) ; port Vin
Net3.3V_LDO_1: 3.3V_LDO.1 R850.2 ; port 3.3V_LDO
NetLD850_1: LD850.1(C) R854.2
NetLD850_2: LD850.2(A) R853.1

Not connected (* = marked no-connect by the designer): U850 2(FB/DNC)* 6(NC)*; U851 2(FB/DNC)* 6(NC)

### Notes on the sheet
- Fraunhofer IISB
- Schottkystr. 10
- developed by:
- 91058 Erlangen
- Germany
- Author
- Project
- License
- Description
- File
- Version
- Release Date
- Sheet
- foxbms.org <https://foxbms.org>
- www.iisb.fraunhofer.de <https://www.iisb.fraunhofer.de/>
- foxBMS Team
- /

### Library data of the parts
3.3V_LDO = Testpoint_Square: Testpoint, square; Automotive Qualified: False; Part Number: Testpoint_Square
C850 C852 = gen_C_ceramic_100n_100V_X7R_0603: as C201 on sheet analog_in; Part Number: gen_C_ceramic_100n_100V_X7R_0603; Supplier 1: Digikey; Supplier Part Number 1: 490-13420-1-ND; Supplier 2: Mouser; Supplier Part Number 2: 81-GCJ188R72A104KA1D
C851 = gen_C_ceramic_2u2_10V_X7R_0805: MLCC; Capacitance: 2u2; Rated Voltage: 10V; Dielectric: X7R; Case EIA: 0805; Case Metric: 2012; Automotive Qualified: True; Part Number: gen_C_ceramic_2u2_10V_X7R_0805; Supplier 1: Farnell; Supplier Part Number 1: 2478259; Supplier 2: Farnell; Supplier Part Number 2: 2070513
LD850 = LED_0603_green_AECQ: TLMG1100-GS08; Manufacturer: Vishay; Breakdown Voltage: 5V; Continuous Forward Current: 20mA; Forward Voltage @ 20mA: 2.1V; Automotive Qualified: True; Part Number: LED_0603_green_AECQ; Color: green; Supplier 1: Farnell; Supplier Part Number 1: 2293494; PnP Package: LED_0603; Operating Temperature: -40°C - 100°C; ComponentLink1Description: Datasheet; ComponentLink1URL: http://www.farnell.com/datasheets/2049164.pdf; Supplier 2: Digikey; Supplier Part Number 2: 751-1165-1-ND
R850 = gen_R_0R_0603: SMD Resistor 0R 0603; Power: 0.1W; Case EIA: 0603; Case Metric: 1608; Maximum Working Voltage: 75V; PnP Package: 0603R; PnP equipped: x; Automotive Qualified: True; Part Number: gen_R_0R_0603; Operating Temperature: -55°C - +155°C; Resistance: 0R; Series: Jumper; PnP Value: 0R; Supplier 1: Farnell; Supplier Part Number 1: 2616580
R851 R853 = gen_R_0R_0603: as R516 on sheet input_filter; Part Number: gen_R_0R_0603; Operating Temperature: -55°C - +155°C; Resistance: 0R; Series: Jumper; PnP Value: 0R; Supplier 1: Farnell; Supplier Part Number 1: 2616580
R852 = gen_R_1M_0603: SMD Resistor 1M 0603; Tolerance: 1%; Power: 0.1W; Case EIA: 0603; Case Metric: 1608; Maximum Working Voltage: 75V; PnP Package: 0603R; Automotive Qualified: True; Part Number: gen_R_1M_0603; Operating Temperature: -55°C - +155°C; Resistance: 1M; Series: E24, E96; PnP Value: 1M; Supplier 1: Farnell; Supplier Part Number 1: 1469746
R854 = gen_R_240R_0603: SMD Resistor 240R 0603; Tolerance: 1%; Power: 0.1W; Case EIA: 0603; Case Metric: 1608; Maximum Working Voltage: 75V; PnP Package: 0603R; Automotive Qualified: True; AEC-Q Norm: AEC-Q200; Part Number: gen_R_240R_0603; Operating Temperature: -55°C - +155°C; Resistance: 240R; Series: E24; PnP Value: 240R; Supplier 1: Mouser; Supplier Part Number 1: 667-ERJ-3EKF2400V; ECCN: EAR99
U850 = TPS7A1633AQDGNRQ1: Automotive 60-V, 5-µA IQ, 100-mA low-dropout (LDO) voltage regulator with enable and power good; Manufacturer: Texas Instruments; PnP Package: HVSSOP-8; Automotive Qualified: True; AEC-Q Norm: AEC-Q100; AEC-Q Grade: Grade 1; Part Number: TPS7A1633AQDGNRQ1; Part Name: TPS7A16A-Q1; Operating Temperature: -40°C - +125°C; ComponentLink1Description: Datasheet; ComponentLink1URL: http://www.ti.com/lit/ds/symlink/tps7a16a-q1.pdf; Supplier 1: Digikey; Supplier Part Number 1: 296-TPS7A1633AQDGNRQ1TR-ND; Supplier 2: Mouser; Supplier Part Number 2: 595-PS7A1633AQDGNRQ1; ECCN: EAR99
U851 = TPS7A1633DRBR: Automotive 60-V, 5-µA IQ, 100-mA low-dropout (LDO) voltage regulator with enable and power good; Part Name: TPS7A16A-Q1; Manufacturer: Texas Instruments; PnP Package: VSON-8; Automotive Qualified: False; Part Number: TPS7A1633DRBR; Operating Temperature: -40°C - +125°C; ComponentLink1Description: Datasheet; ComponentLink1URL: https://www.ti.com/lit/ds/symlink/tps7a16.pdf; Supplier 1: Mouser; Supplier Part Number 1: 595-TPS7A1633DRBR / 595-TPS7A1633DRBR / 595-TPS7A1633DRBR; ECCN: EAR99

## Sheet connectors_new.SchDoc
size A4
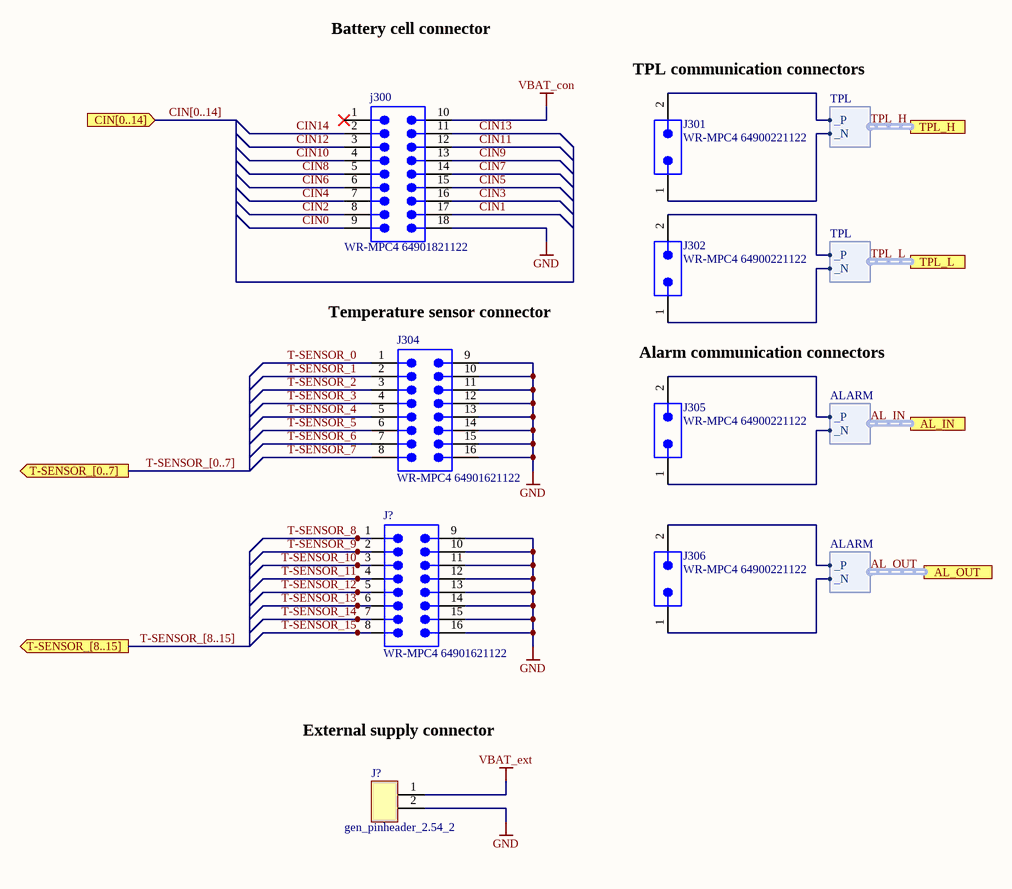
[diagram p6: connectors_new.SchDoc]

### Parts
(Parts that share a designator on the sheet are numbered #1, #2 ... from top to bottom, then left to right.)
j300#2  WR-MPC4 64901821122  [64901821122]
J301#2  WR-MPC4 64900221122  [64900221122]
J302#2  WR-MPC4 64900221122  [64900221122]
J304#2  WR-MPC4 64901621122  [64901621122]
J305#2  WR-MPC4 64900221122  [64900221122]
J306#2  WR-MPC4 64900221122  [64900221122]
J?#1  WR-MPC4 64901621122  [64901621122]
J?#2  gen_pinheader_2.54_2  [Pinheader_2.54_2]

### Ports
AL_IN (harness ALARM), AL_OUT (harness ALARM), CIN[0..14] (in), T-SENSOR_[0..7] (out), T-SENSOR_[8..15] (out), TPL_H (harness TPL), TPL_L (harness TPL)

### Harnesses
TPL: _P, _N
ALARM: _P, _N

### Nets
GND: j300#2.18 J304#2.9 J304#2.10 J304#2.11 J304#2.12 J304#2.13 J304#2.14 J304#2.15 J304#2.16 J?#1.9 J?#1.10 J?#1.11 J?#1.12 J?#1.13 J?#1.14 J?#1.15 J?#1.16 J?#2.2
VBAT_con: j300#2.10
VBAT_ext: J?#2.1
AL_IN._N: J305#2.1 ; port AL_IN._N
AL_IN._P: J305#2.2 ; port AL_IN._P
AL_OUT._N: J306#2.1 ; port AL_OUT._N
AL_OUT._P: J306#2.2 ; port AL_OUT._P
CIN0: j300#2.9
CIN1: j300#2.17
CIN2: j300#2.8
CIN3: j300#2.16
CIN4: j300#2.7
CIN5: j300#2.15
CIN6: j300#2.6
CIN7: j300#2.14
CIN8: j300#2.5
CIN9: j300#2.13
CIN10: j300#2.4
CIN11: j300#2.12
CIN12: j300#2.3
CIN13: j300#2.11
CIN14: j300#2.2
T-SENSOR_0: J304#2.1
T-SENSOR_1: J304#2.2
T-SENSOR_2: J304#2.3
T-SENSOR_3: J304#2.4
T-SENSOR_4: J304#2.5
T-SENSOR_5: J304#2.6
T-SENSOR_6: J304#2.7
T-SENSOR_7: J304#2.8
T-SENSOR_8: J?#1.1
T-SENSOR_9: J?#1.2
T-SENSOR_10: J?#1.3
T-SENSOR_11: J?#1.4
T-SENSOR_12: J?#1.5
T-SENSOR_13: J?#1.6
T-SENSOR_14: J?#1.7
T-SENSOR_15: J?#1.8
TPL_H._N: J301#2.1 ; port TPL_H._N
TPL_H._P: J301#2.2 ; port TPL_H._P
TPL_L._N: J302#2.1 ; port TPL_L._N
TPL_L._P: J302#2.2 ; port TPL_L._P

Not connected (* = marked no-connect by the designer): j300#2 1*

### Buses and harness runs
bus CIN[0..14] = port CIN[0..14]
bus T-SENSOR_[0..7] = port T-SENSOR_[0..7]
bus T-SENSOR_[8..15] = port T-SENSOR_[8..15]
harness AL_IN = port AL_IN
harness AL_OUT = port AL_OUT
harness TPL_H = port TPL_H
harness TPL_L = port TPL_L

### Notes on the sheet
- Battery cell connector
- (near J301#2) TPL communication connectors
- (near J304#2) Temperature sensor connector
- Alarm communication connectors
- External supply connector

### Library data of the parts
j300#2 = CMP-1502-00501-2: NexarPartId: 23024638; Number of Positions: 18; Current Rating: 6A; Gender: Male; Operating Supply Voltage: 600V; Insulation Resistance: 1GΩ; Contact Resistance: 10mΩ; Connector Type: Male Pin, Socket; Row Spacing: 4.191mm; Pitch: 4.2mm; Color: White; Height: 12.8mm; Orientation: Vertical; Width: 39.1mm; Contact Material: Copper; Number of Contacts: 18; Max Operating Temperature: 105°C; Number of Rows: 2; RoHS: Compliant; Min Operating Temperature: -40°C; Contact Plating: Tin; Length: 39mm; Mount: Through Hole; Termination: Solder; Lead Pitch: 4.2mm; REACH SVHC: Unknown; Number of Pins: 18; Fastening Type: Ramp
J301#2 J302#2 J305#2 J306#2 = CMP-1502-00493-2: NexarPartId: 8917578; Contact Resistance: 10mΩ; Operating Supply Voltage: 600V; Current Rating: 9A; Gender: Male; Number of Contacts: 2; Lead Length: 3.5mm; Connector Type: Male Pin, Socket; Pitch: 4.2mm; Row Spacing: 5.5118mm; Insulation Resistance: 1GΩ; Height: 12.8mm; Max Operating Temperature: 105°C; Color: White; Number of Rows: 2; Voltage Rating: 600V; Termination: Solder; Fastening Type: Ramp; Width: 5.5mm; Min Operating Temperature: -40°C; Length: 5.4mm; Mount: Through Hole; Flammability Rating: UL94 V-0; Contact Gender: Male; Contact Material: Copper; Lead Pitch: 4.2mm; Housing Material: Nylon; Contact Plating: Tin; Number of Pins: 2; RoHS: Compliant; Orientation: Vertical; REACH SVHC: Unknown; Number of Positions: 2
J304#2 J?#1 = CMP-1502-00500-2: NexarPartId: 23024631; Pitch: 4.2mm; Gender: Male; Row Spacing: 4.191mm; Operating Supply Voltage: 600V; Insulation Resistance: 1GΩ; Connector Type: Male Pin, Socket; Contact Resistance: 10mΩ; Number of Positions: 16; Current Rating: 6A; Fastening Type: Ramp; Lead Pitch: 4.2mm; REACH SVHC: Unknown; Number of Pins: 16; RoHS: Compliant; Color: White; Mount: Through Hole; Contact Material: Copper; Width: 34.9mm; Max Operating Temperature: 105°C; Min Operating Temperature: -40°C; Height: 12.8mm; Termination: Solder; Orientation: Vertical; Length: 34.8mm; Contact Plating: Tin; Number of Rows: 2; Number of Contacts: 16
J?#2 = gen_pinheader_2.54_2: as J310 on sheet connectors_org; Part Number: gen_pinheader_2.54_2; Part Name: PinHeader; Operating Temperature: −40 °C - +105 °C; Supplier 1: Farnell; Supplier Part Number 1: 2505044

## Sheet connectors.SchDoc
size A3
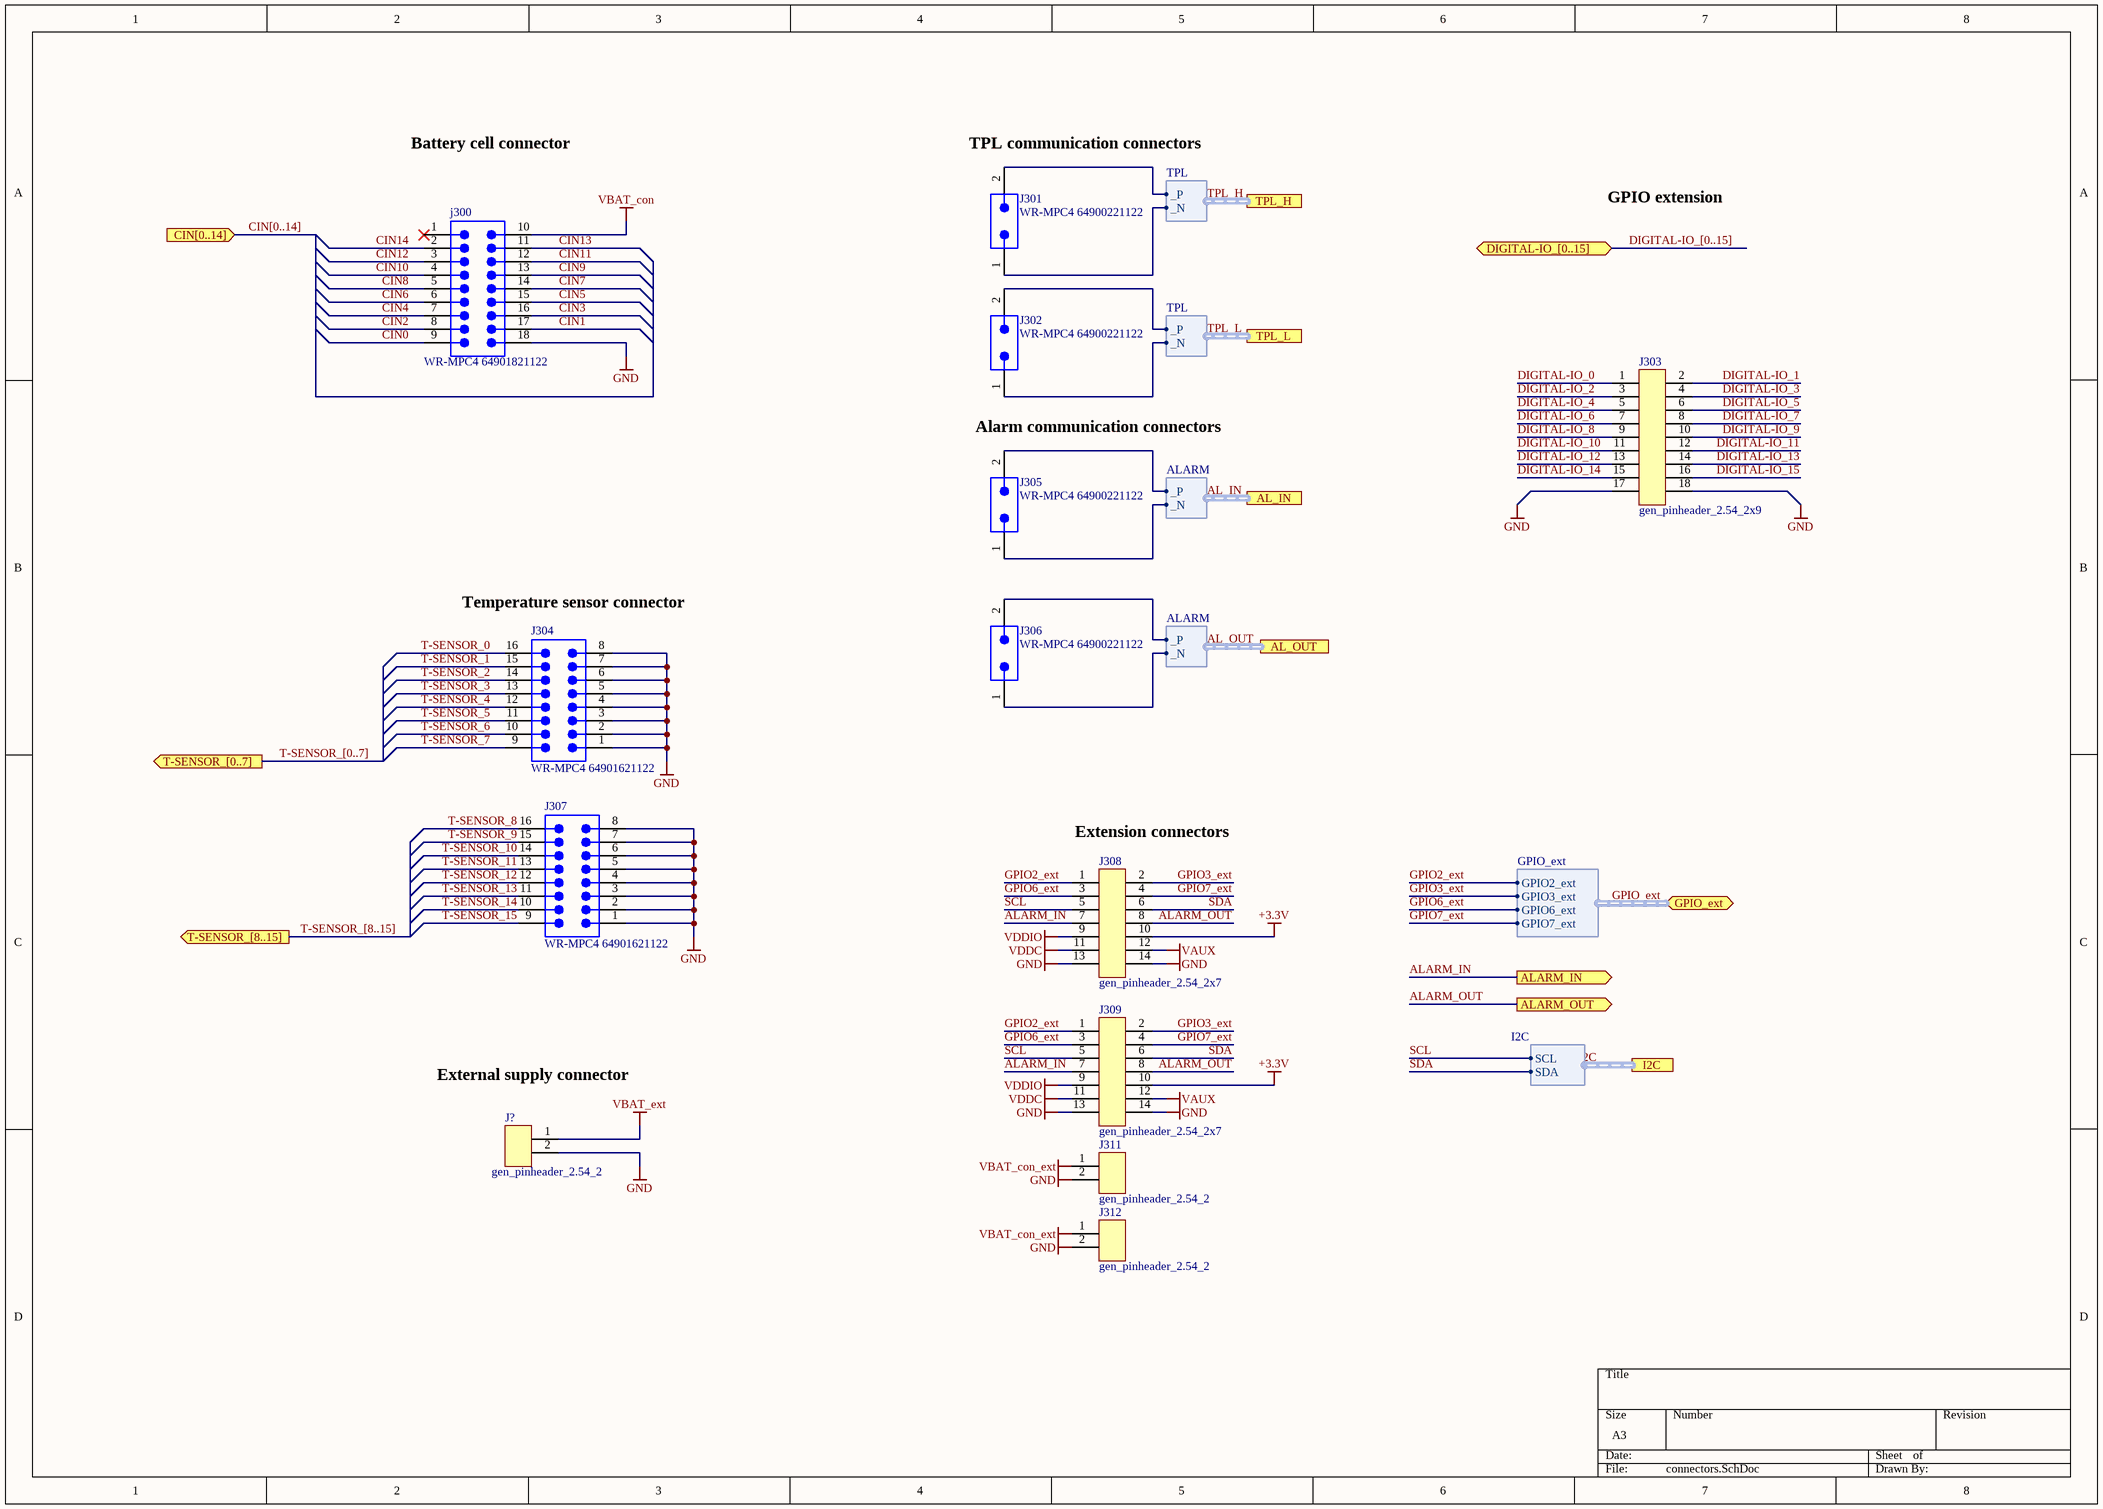
[diagram p7: connectors.SchDoc]

### Parts
(Parts that share a designator on the sheet are numbered #1, #2 ... from top to bottom, then left to right.)
j300#3  WR-MPC4 64901821122  [64901821122]
J301#3  WR-MPC4 64900221122  [64900221122]
J302#3  WR-MPC4 64900221122  [64900221122]
J303#2  gen_pinheader_2.54_2x9  [Pinheader_2.54_2x9]
J304#3  WR-MPC4 64901621122  [64901621122]
J305#3  WR-MPC4 64900221122  [64900221122]
J306#3  WR-MPC4 64900221122  [64900221122]
J307#2  WR-MPC4 64901621122  [64901621122]
J308#2  gen_pinheader_2.54_2x7  [Pinheader_2.54_2x7]
J309#2  gen_pinheader_2.54_2x7  [Pinheader_2.54_2x7]
J311#2  gen_pinheader_2.54_2  [Pinheader_2.54_2]
J312#2  gen_pinheader_2.54_2  [Pinheader_2.54_2]
J?#3  gen_pinheader_2.54_2  [Pinheader_2.54_2]

### Ports
AL_IN (harness ALARM), AL_OUT (harness ALARM), ALARM_IN (out), ALARM_OUT (out), CIN[0..14] (in), DIGITAL-IO_[0..15] (bidir), GPIO_ext (bidir, harness GPIO_ext), I2C (harness I2C), T-SENSOR_[0..7] (out), T-SENSOR_[8..15] (out), TPL_H (harness TPL), TPL_L (harness TPL)

### Harnesses
GPIO_ext: GPIO3_ext, GPIO2_ext, GPIO6_ext, GPIO7_ext
I2C: SCL, SDA
TPL: _P, _N
ALARM: _P, _N

### Nets
+3.3V: J308#2.10 J309#2.10
GND: j300#3.18 J303#2.17 J303#2.18 J304#3.1 J304#3.2 J304#3.3 J304#3.4 J304#3.5 J304#3.6 J304#3.7 J304#3.8 J307#2.1 J307#2.2 J307#2.3 J307#2.4 J307#2.5 J307#2.6 J307#2.7 J307#2.8 J308#2.13 J308#2.14 J309#2.13 J309#2.14 J311#2.2 J312#2.2 J?#3.2
VAUX: J308#2.12 J309#2.12
VBAT_con: j300#3.10
VBAT_con_ext: J311#2.1 J312#2.1
VBAT_ext: J?#3.1
VDDC: J308#2.11 J309#2.11
VDDIO: J308#2.9 J309#2.9
AL_IN._N: J305#3.1 ; port AL_IN._N
AL_IN._P: J305#3.2 ; port AL_IN._P
AL_OUT._N: J306#3.1 ; port AL_OUT._N
AL_OUT._P: J306#3.2 ; port AL_OUT._P
ALARM_IN: J308#2.7 J309#2.7 ; port ALARM_IN
ALARM_OUT: J308#2.8 J309#2.8 ; port ALARM_OUT
CIN0: j300#3.9
CIN1: j300#3.17
CIN2: j300#3.8
CIN3: j300#3.16
CIN4: j300#3.7
CIN5: j300#3.15
CIN6: j300#3.6
CIN7: j300#3.14
CIN8: j300#3.5
CIN9: j300#3.13
CIN10: j300#3.4
CIN11: j300#3.12
CIN12: j300#3.3
CIN13: j300#3.11
CIN14: j300#3.2
DIGITAL-IO_0: J303#2.1
DIGITAL-IO_1: J303#2.2
DIGITAL-IO_2: J303#2.3
DIGITAL-IO_3: J303#2.4
DIGITAL-IO_4: J303#2.5
DIGITAL-IO_5: J303#2.6
DIGITAL-IO_6: J303#2.7
DIGITAL-IO_7: J303#2.8
DIGITAL-IO_8: J303#2.9
DIGITAL-IO_9: J303#2.10
DIGITAL-IO_10: J303#2.11
DIGITAL-IO_11: J303#2.12
DIGITAL-IO_12: J303#2.13
DIGITAL-IO_13: J303#2.14
DIGITAL-IO_14: J303#2.15
DIGITAL-IO_15: J303#2.16
GPIO2_ext: J308#2.1 J309#2.1 ; port GPIO_ext.GPIO2_ext
GPIO3_ext: J308#2.2 J309#2.2 ; port GPIO_ext.GPIO3_ext
GPIO6_ext: J308#2.3 J309#2.3 ; port GPIO_ext.GPIO6_ext
GPIO7_ext: J308#2.4 J309#2.4 ; port GPIO_ext.GPIO7_ext
SCL: J308#2.5 J309#2.5 ; port I2C.SCL  [project net I2C.SCL]
SDA: J308#2.6 J309#2.6 ; port I2C.SDA  [project net I2C.SDA]
T-SENSOR_0: J304#3.16
T-SENSOR_1: J304#3.15
T-SENSOR_2: J304#3.14
T-SENSOR_3: J304#3.13
T-SENSOR_4: J304#3.12
T-SENSOR_5: J304#3.11
T-SENSOR_6: J304#3.10
T-SENSOR_7: J304#3.9
T-SENSOR_8: J307#2.16
T-SENSOR_9: J307#2.15
T-SENSOR_10: J307#2.14
T-SENSOR_11: J307#2.13
T-SENSOR_12: J307#2.12
T-SENSOR_13: J307#2.11
T-SENSOR_14: J307#2.10
T-SENSOR_15: J307#2.9
TPL_H._N: J301#3.1 ; port TPL_H._N
TPL_H._P: J301#3.2 ; port TPL_H._P
TPL_L._N: J302#3.1 ; port TPL_L._N
TPL_L._P: J302#3.2 ; port TPL_L._P

Not connected (* = marked no-connect by the designer): j300#3 1*

### Buses and harness runs
bus CIN[0..14] = port CIN[0..14]
bus DIGITAL-IO_[0..15] = port DIGITAL-IO_[0..15]
bus T-SENSOR_[0..7] = port T-SENSOR_[0..7]
bus T-SENSOR_[8..15] = port T-SENSOR_[8..15]
harness AL_IN = port AL_IN
harness AL_OUT = port AL_OUT
harness GPIO_ext = port GPIO_ext
harness I2C = port I2C
harness TPL_H = port TPL_H
harness TPL_L = port TPL_L

### Notes on the sheet
- Battery cell connector
- (near J301#3) TPL communication connectors
- GPIO extension
- Alarm communication connectors
- (near J304#3) Temperature sensor connector
- (near J308#2) Extension connectors
- External supply connector

### Library data of the parts
j300#3 = CMP-1502-00501-2: as j300#2 on sheet connectors_new; Color: White; Height: 12.8mm; Orientation: Vertical; Width: 39.1mm; Contact Material: Copper; Number of Contacts: 18; Max Operating Temperature: 105°C; Number of Rows: 2; RoHS: Compliant; Min Operating Temperature: -40°C; Contact Plating: Tin; Length: 39mm; Mount: Through Hole; Termination: Solder; Lead Pitch: 4.2mm; REACH SVHC: Unknown; Number of Pins: 18; Fastening Type: Ramp
J301#3 J302#3 J305#3 J306#3 = CMP-1502-00493-2: as J301#2 on sheet connectors_new; Height: 12.8mm; Max Operating Temperature: 105°C; Color: White; Number of Rows: 2; Voltage Rating: 600V; Termination: Solder; Fastening Type: Ramp; Width: 5.5mm; Min Operating Temperature: -40°C; Length: 5.4mm; Mount: Through Hole; Flammability Rating: UL94 V-0; Contact Gender: Male; Contact Material: Copper; Lead Pitch: 4.2mm; Housing Material: Nylon; Contact Plating: Tin; Number of Pins: 2; RoHS: Compliant; Orientation: Vertical; REACH SVHC: Unknown; Number of Positions: 2
J303#2 = gen_pinheader_2.54_2x9: as J303#1 on sheet connectors_org; Part Number: gen_pinheader_2.54_2x9; Part Name: PinHeader; Operating Temperature: −40 °C - +105 °C; Supplier 1: Farnell; Supplier Part Number 1: 2025256
J304#3 J307#2 = CMP-1502-00500-2: as J304#2 on sheet connectors_new; Fastening Type: Ramp; Lead Pitch: 4.2mm; REACH SVHC: Unknown; Number of Pins: 16; RoHS: Compliant; Color: White; Mount: Through Hole; Contact Material: Copper; Width: 34.9mm; Max Operating Temperature: 105°C; Min Operating Temperature: -40°C; Height: 12.8mm; Termination: Solder; Orientation: Vertical; Length: 34.8mm; Contact Plating: Tin; Number of Rows: 2; Number of Contacts: 16
J308#2 J309#2 = gen_pinheader_2.54_2x7: as J308#1 on sheet connectors_org; Part Number: gen_pinheader_2.54_2x7; Part Name: PinHeader; Operating Temperature: −40 °C - +105 °C; Supplier 1: Mouser; Supplier Part Number 1: 200-TSW10707GD
J311#2 J312#2 J?#3 = gen_pinheader_2.54_2: as J310 on sheet connectors_org; Part Number: gen_pinheader_2.54_2; Part Name: PinHeader; Operating Temperature: −40 °C - +105 °C; Supplier 1: Farnell; Supplier Part Number 1: 2505044

## Nets that join several sheets
+3.3V: connectors_org (J308#1.10 J309#1.10), sensors (C923.2 U922.8), connectors (J308#2.10 J309#2.10)
GND: input_filter (32 pins), analog_in (27 pins), connectors_org (26 pins), sensors (16 pins), digital_io (20 pins), ldo (8 pins), connectors_new (18 pins), connectors (26 pins)
VAUX: analog_in (R200.2), connectors_org (J308#1.12 J309#1.12), connectors (J308#2.12 J309#2.12)
VBAT_con: connectors_org (J300#1.9), connectors_new (j300#2.10), connectors (j300#3.10)
VBAT_con_ext: connectors_org (J311#1.1 J312#1.1), connectors (J311#2.1 J312#2.1)
VBAT_ext: connectors_org (J310.1), connectors_new (J?#2.1), connectors (J?#3.1)
VDDC: analog_in (C200.2 C201.2 U200.2), connectors_org (J308#1.11 J309#1.11), connectors (J308#2.11 J309#2.11)
VDDIO: analog_in (7 pins), connectors_org (J308#1.9 J309#1.9), sensors (14 pins), digital_io (19 pins), connectors (J308#2.9 J309#2.9)